# EAGLE schematic PDC Senior Project (EAGLE 7.7.0)
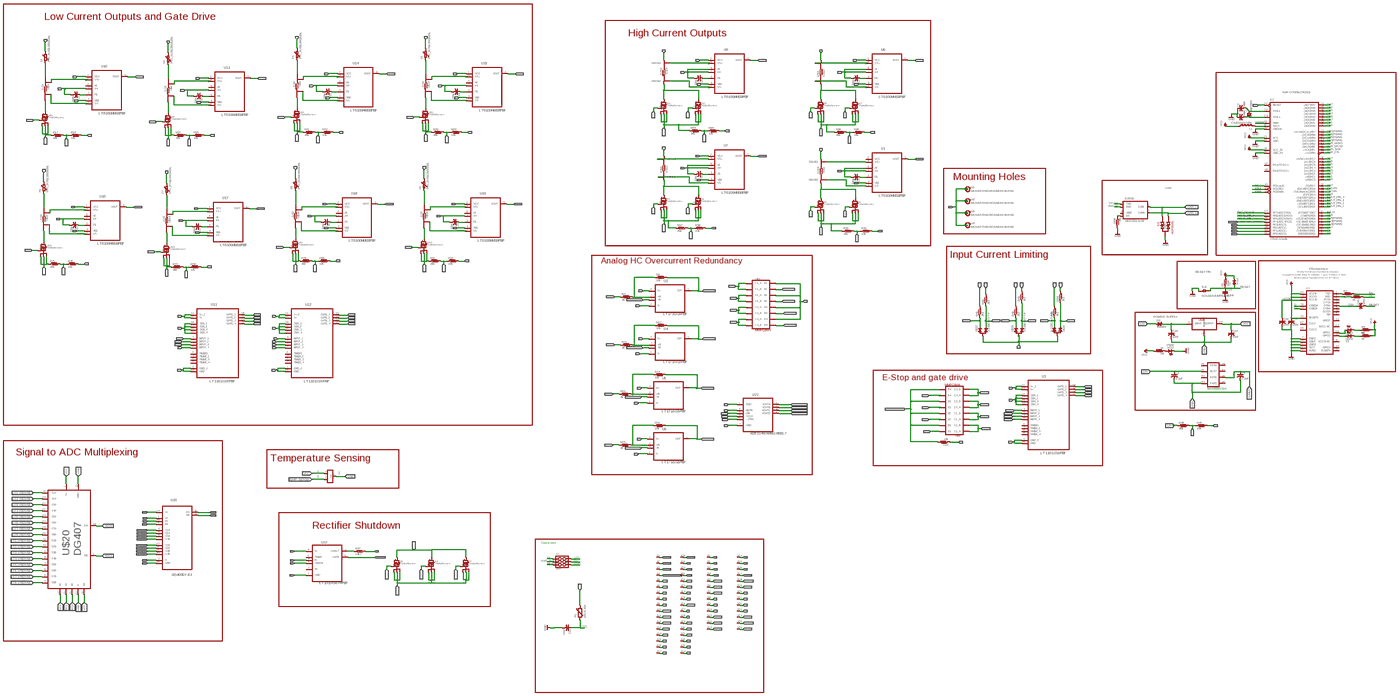
[diagram p0: schematic, sheet 1, overview]
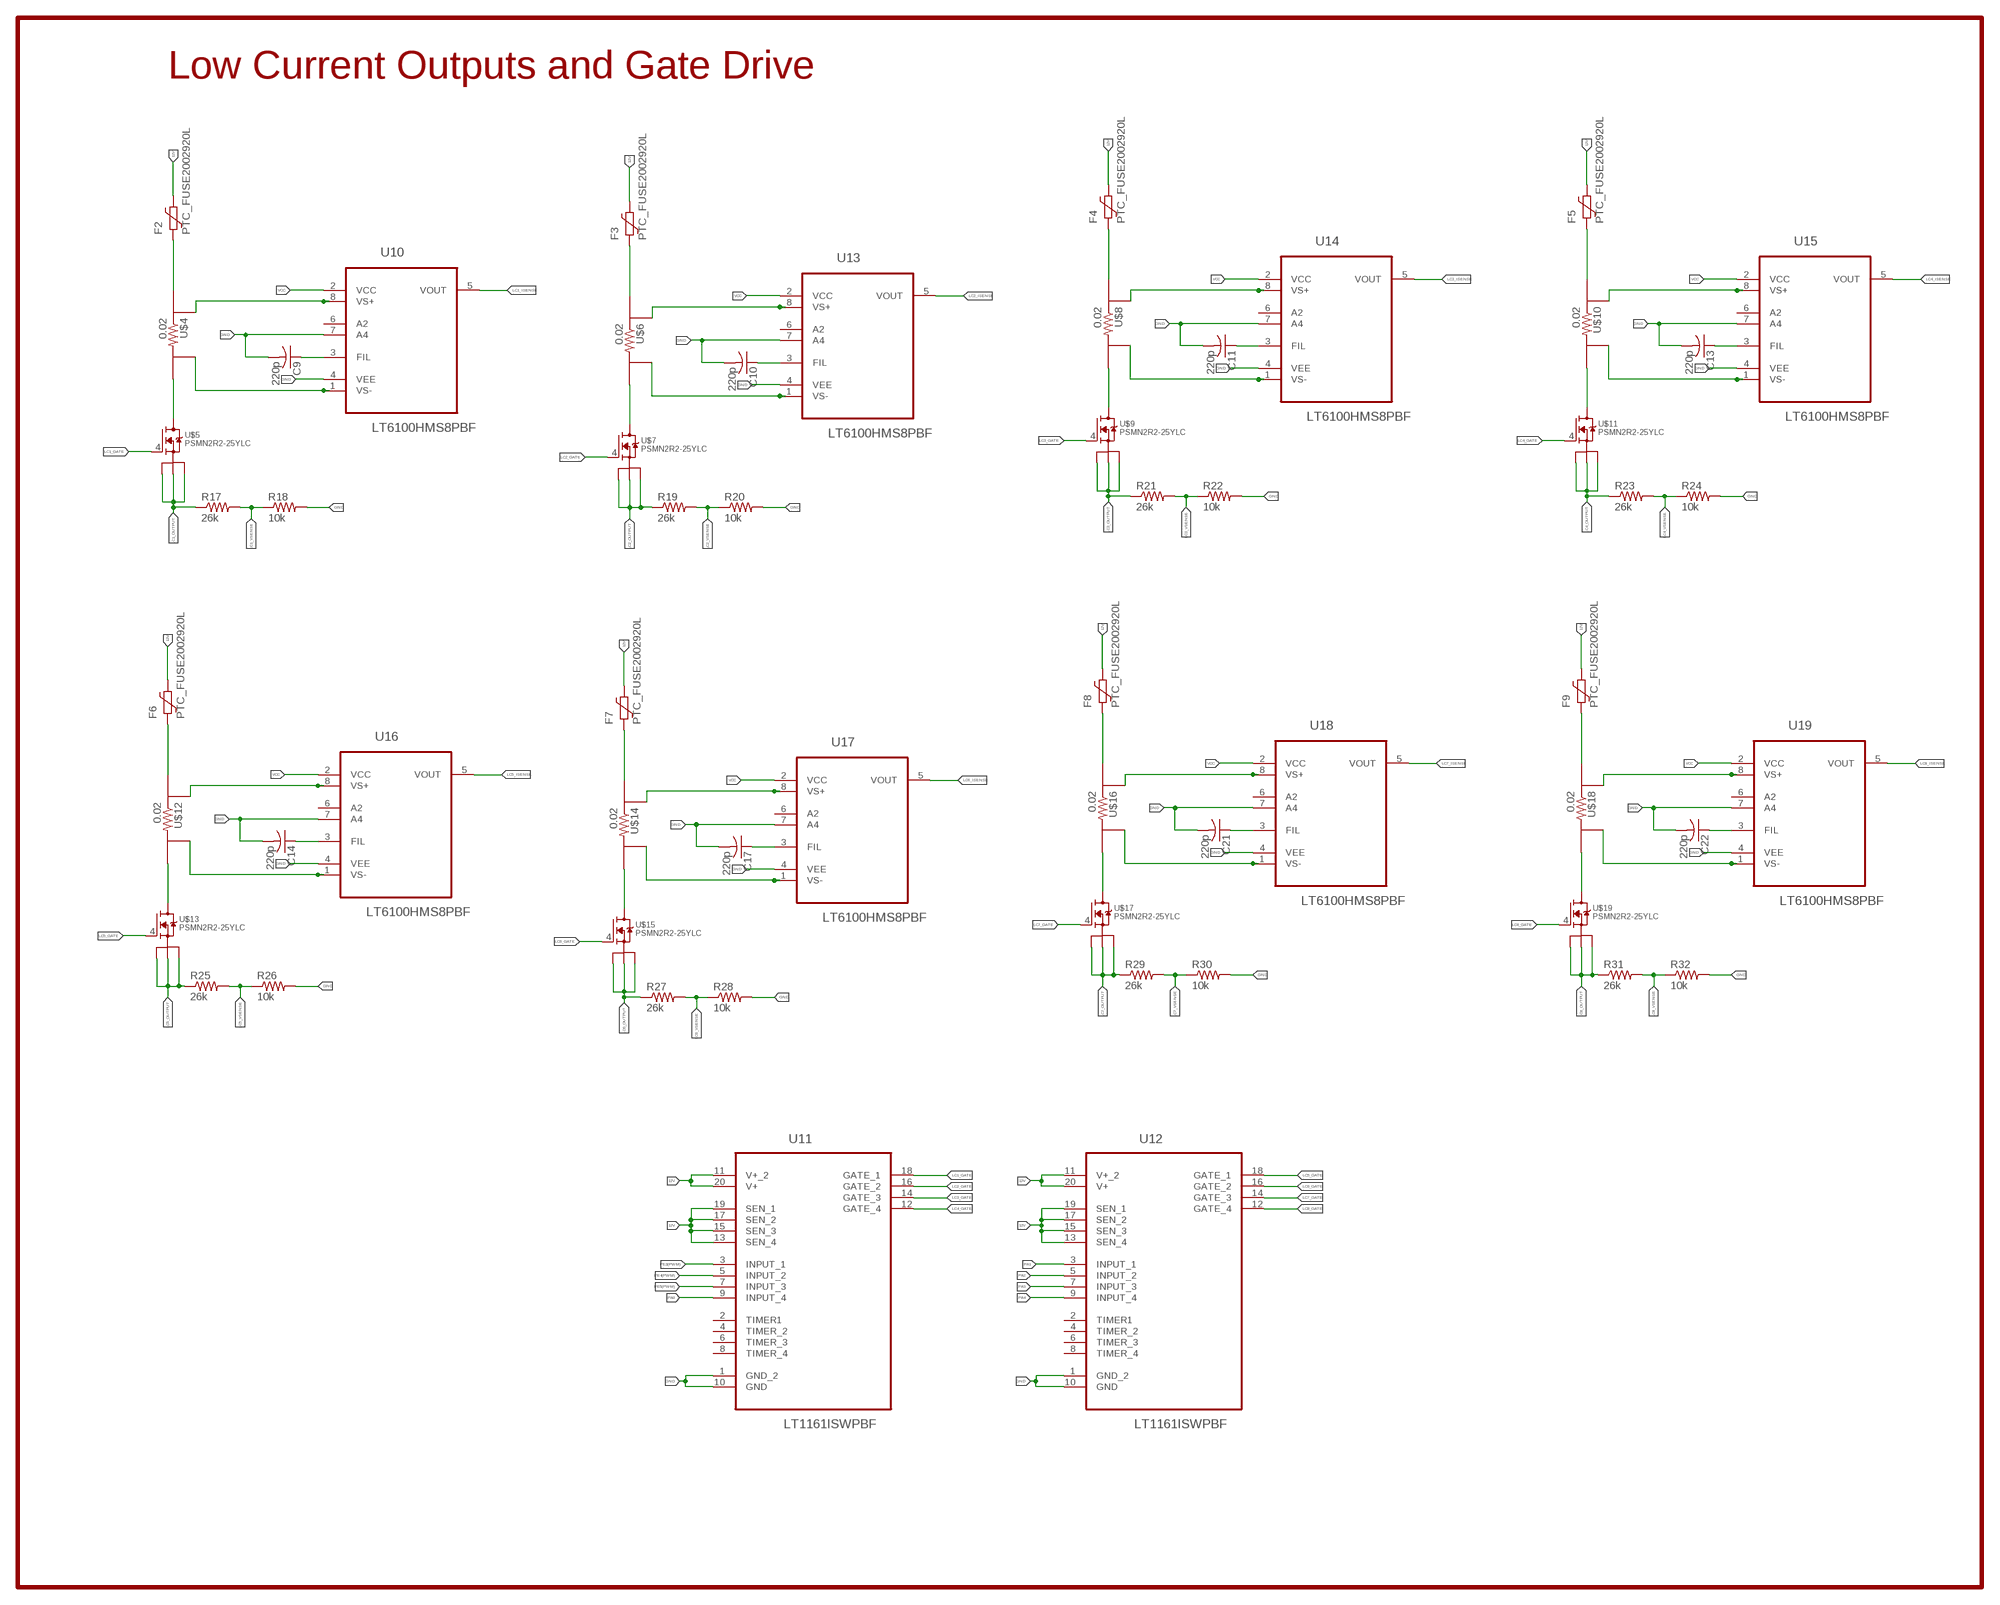
[diagram p1: schematic, sheet 1, part 1 of 6]
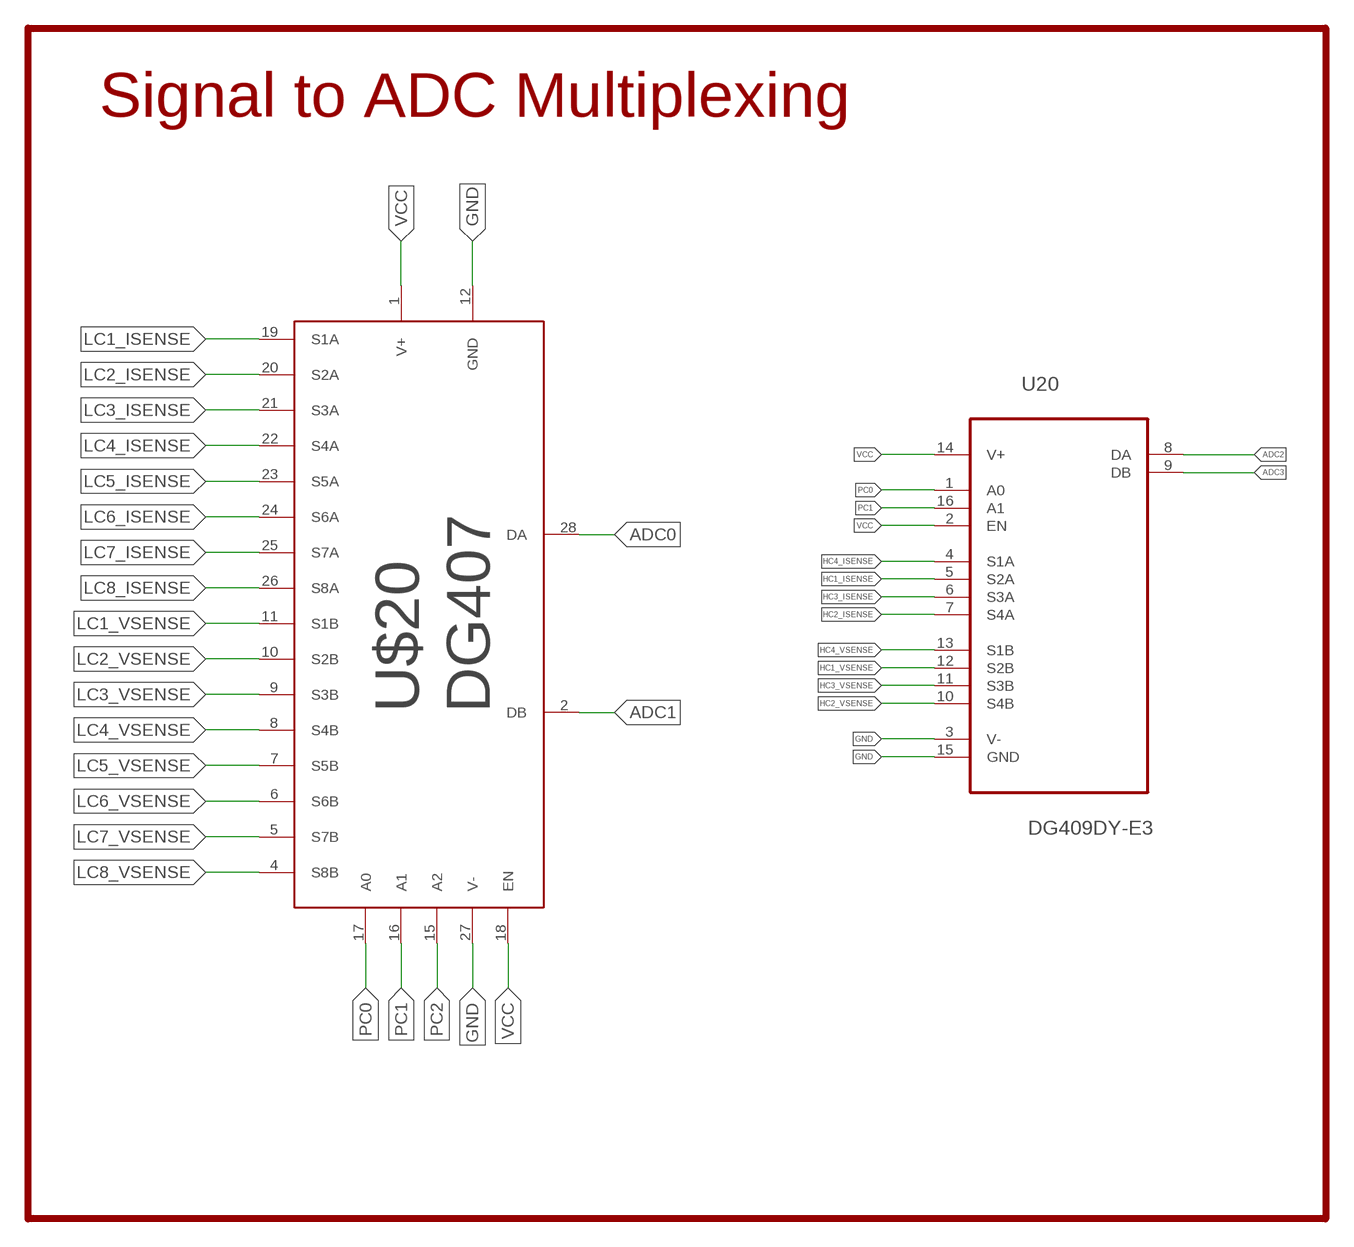
[diagram p2: schematic, sheet 1, part 2 of 6]
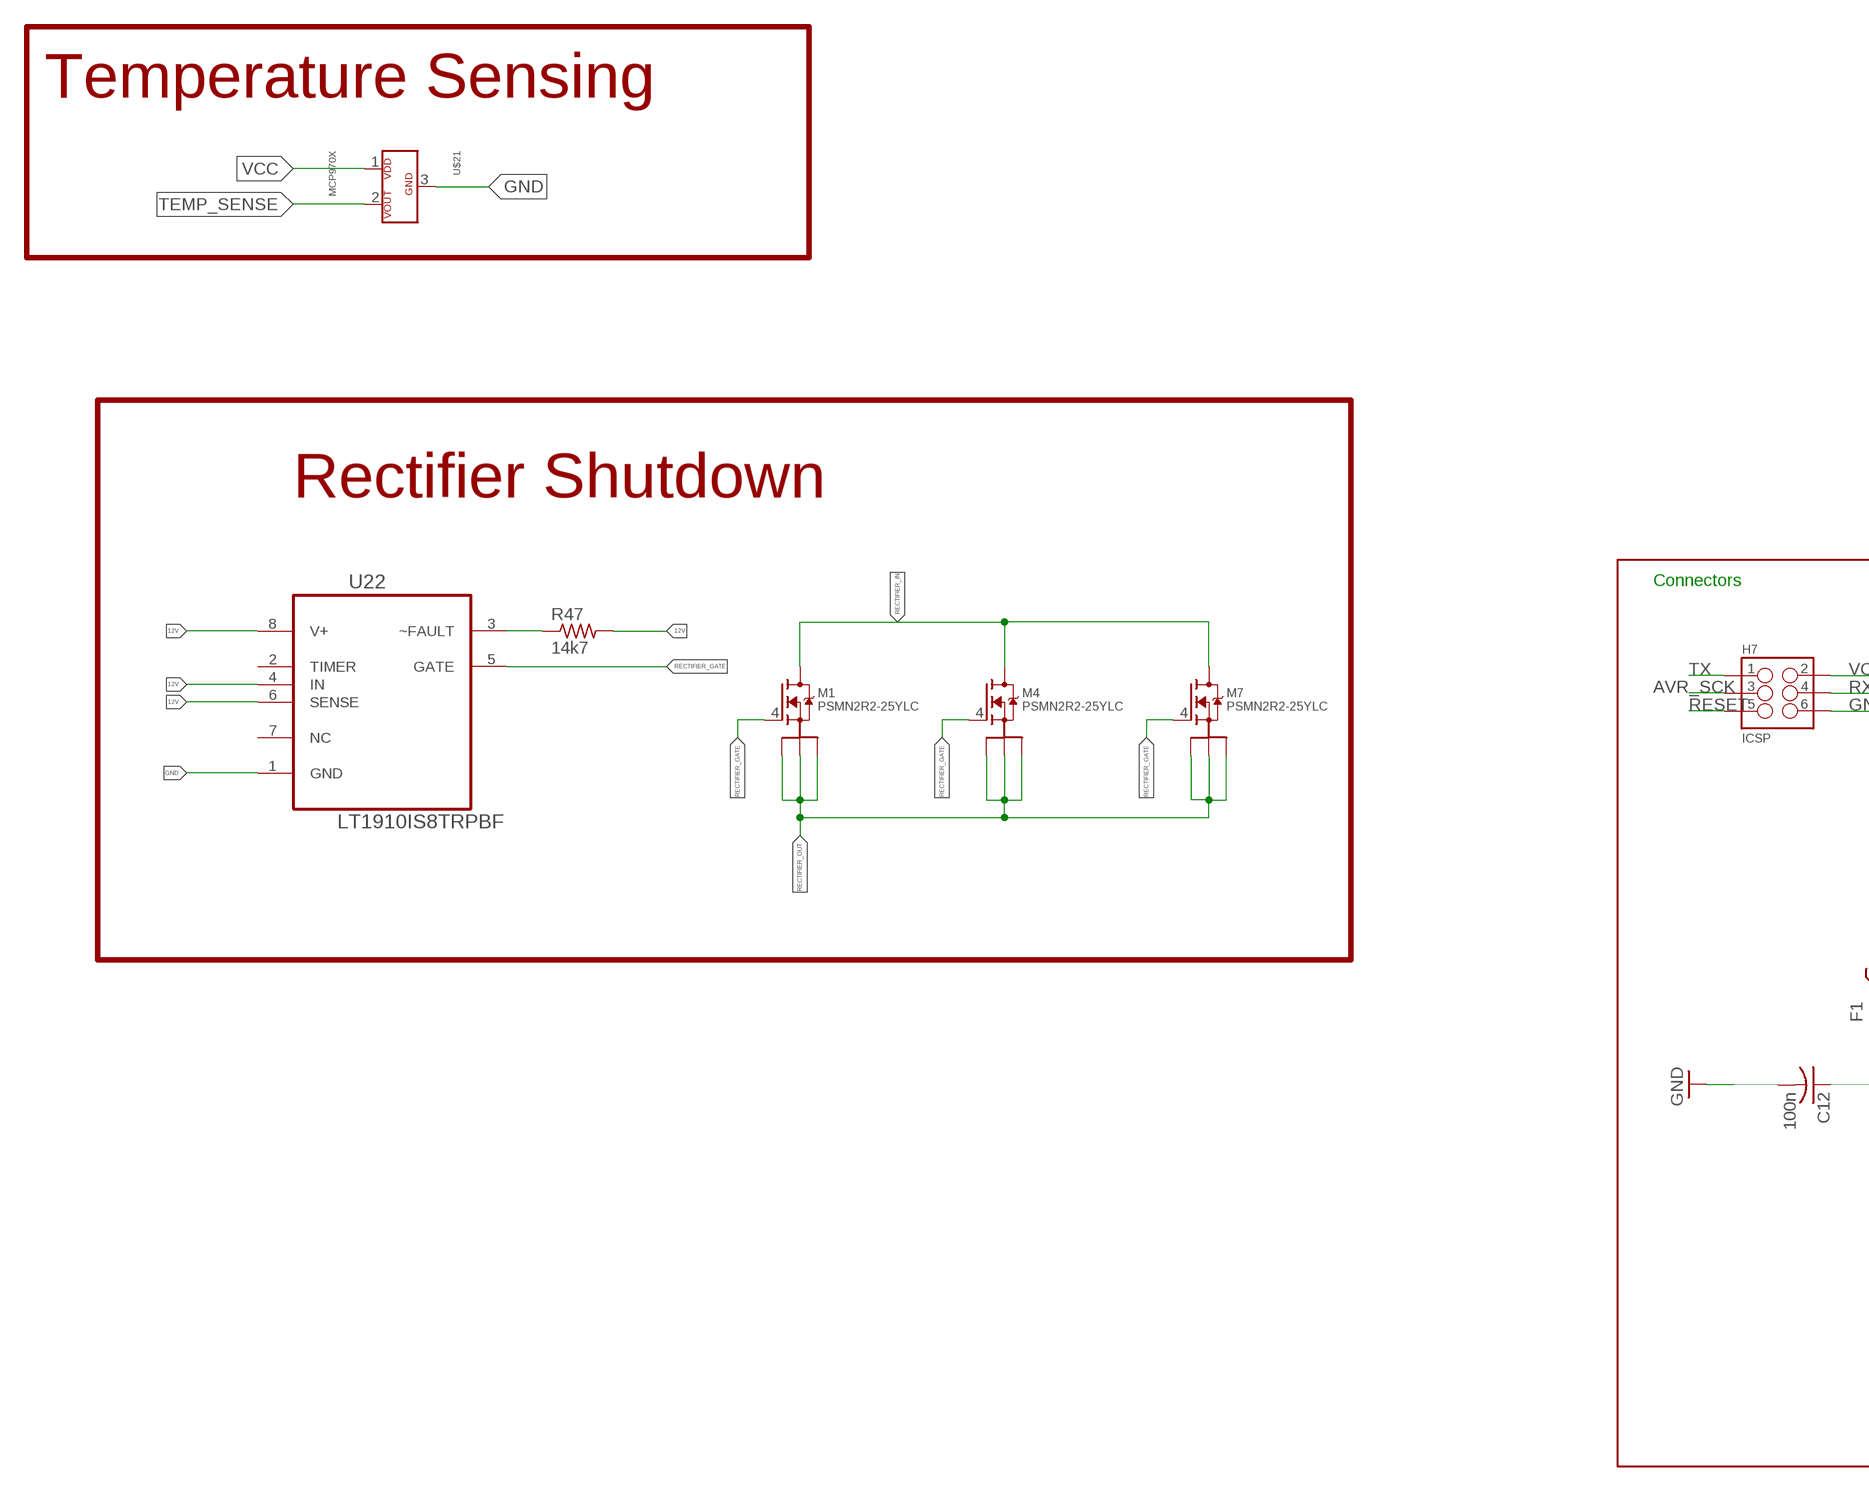
[diagram p3: schematic, sheet 1, part 3 of 6]
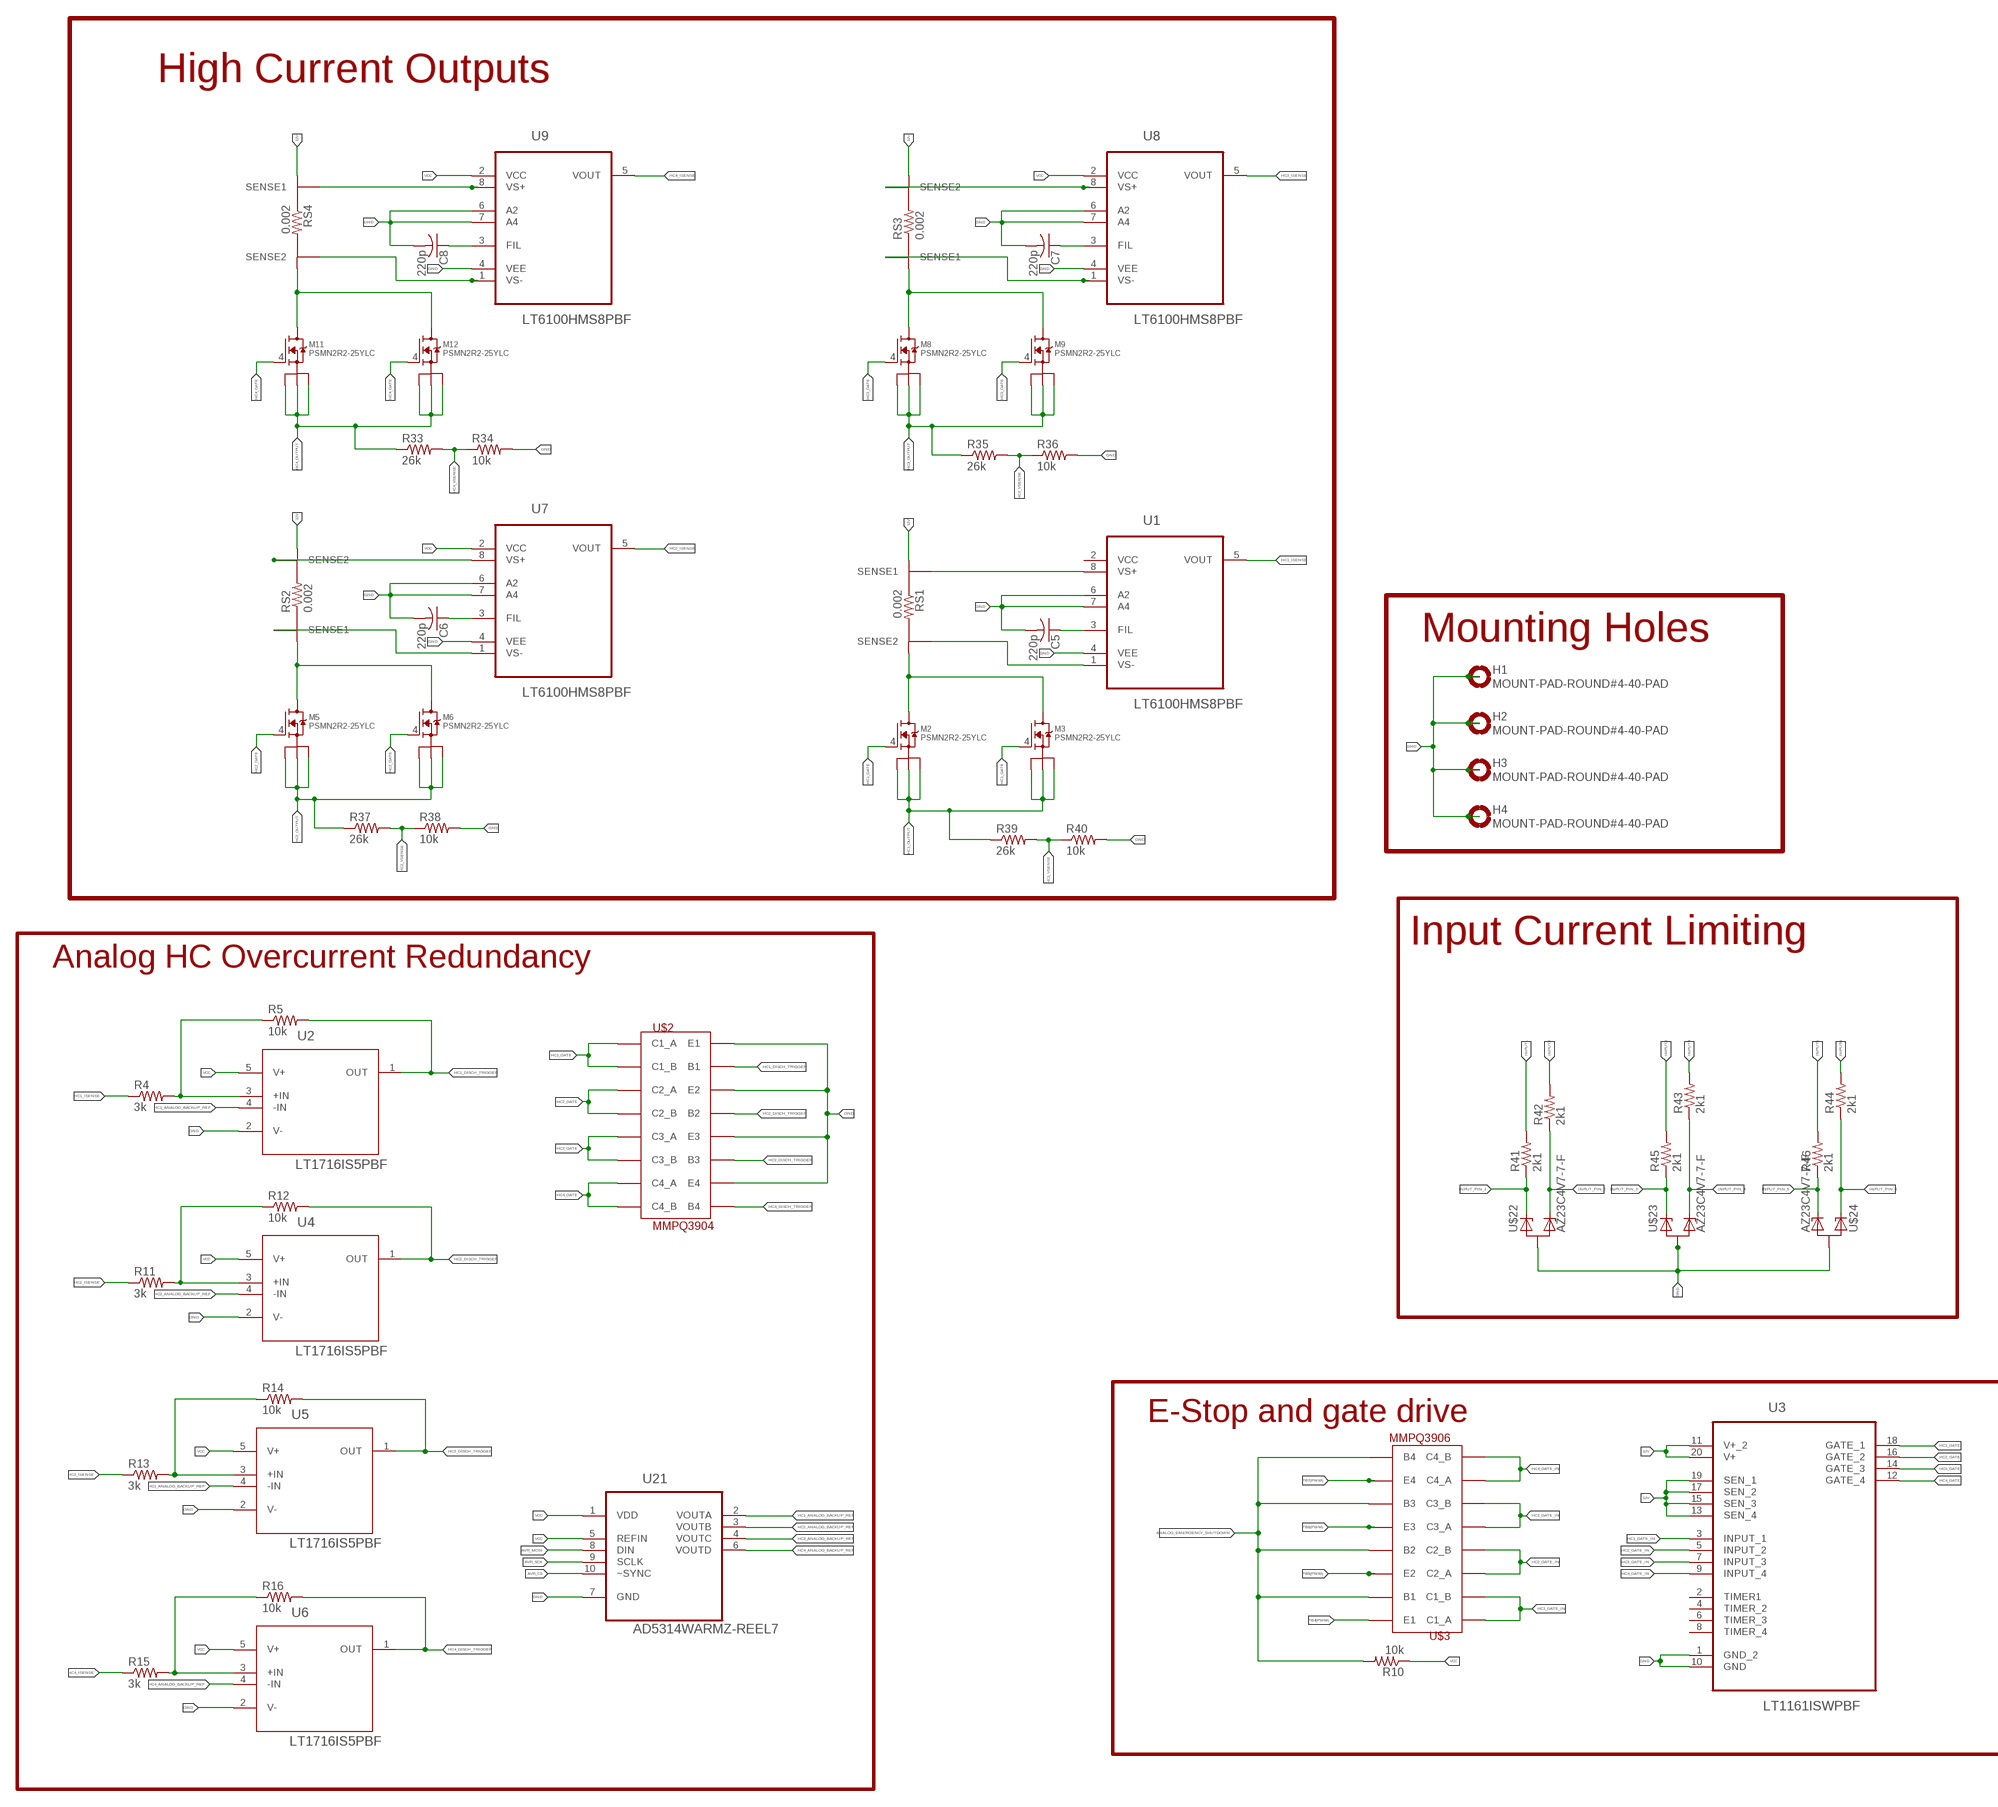
[diagram p4: schematic, sheet 1, part 4 of 6]
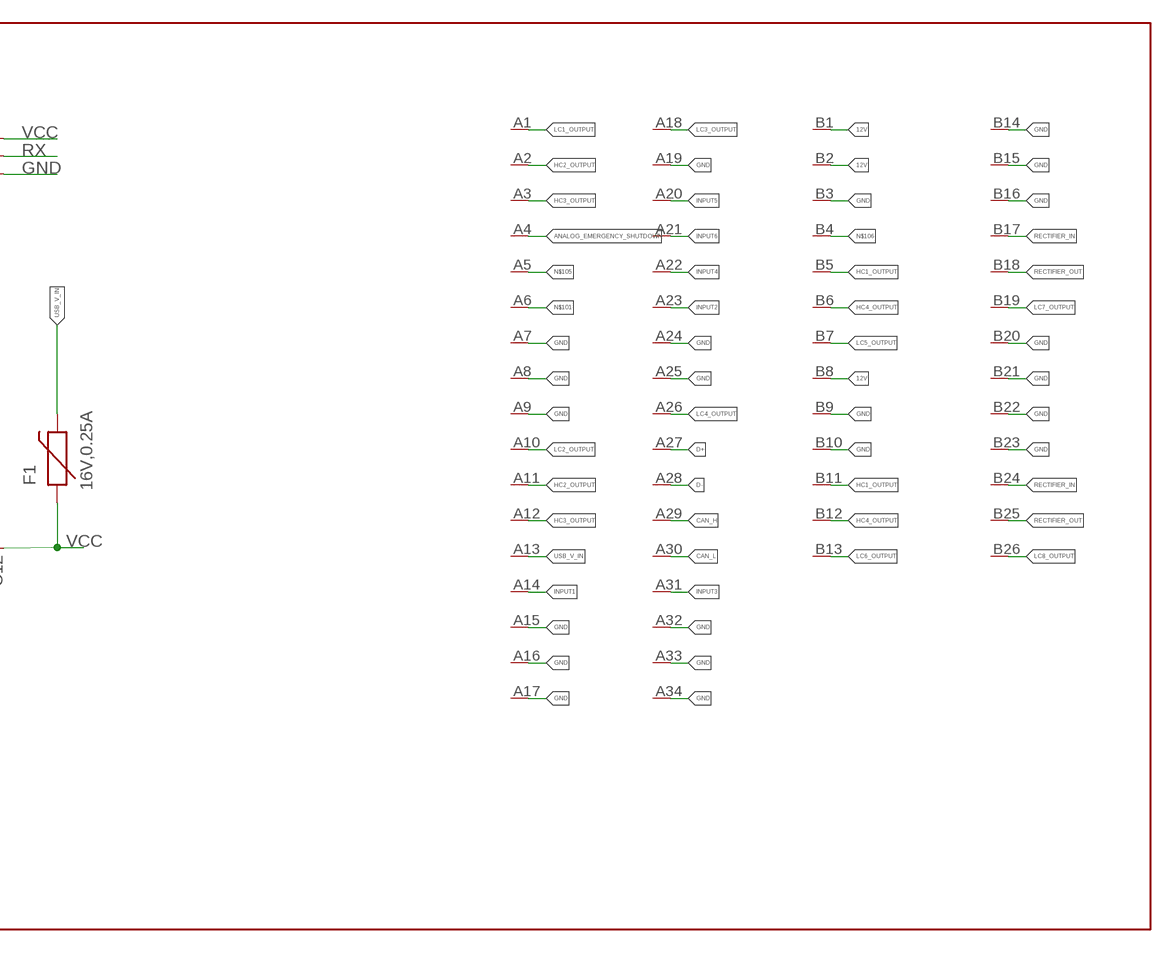
[diagram p5: schematic, sheet 1, part 5 of 6]
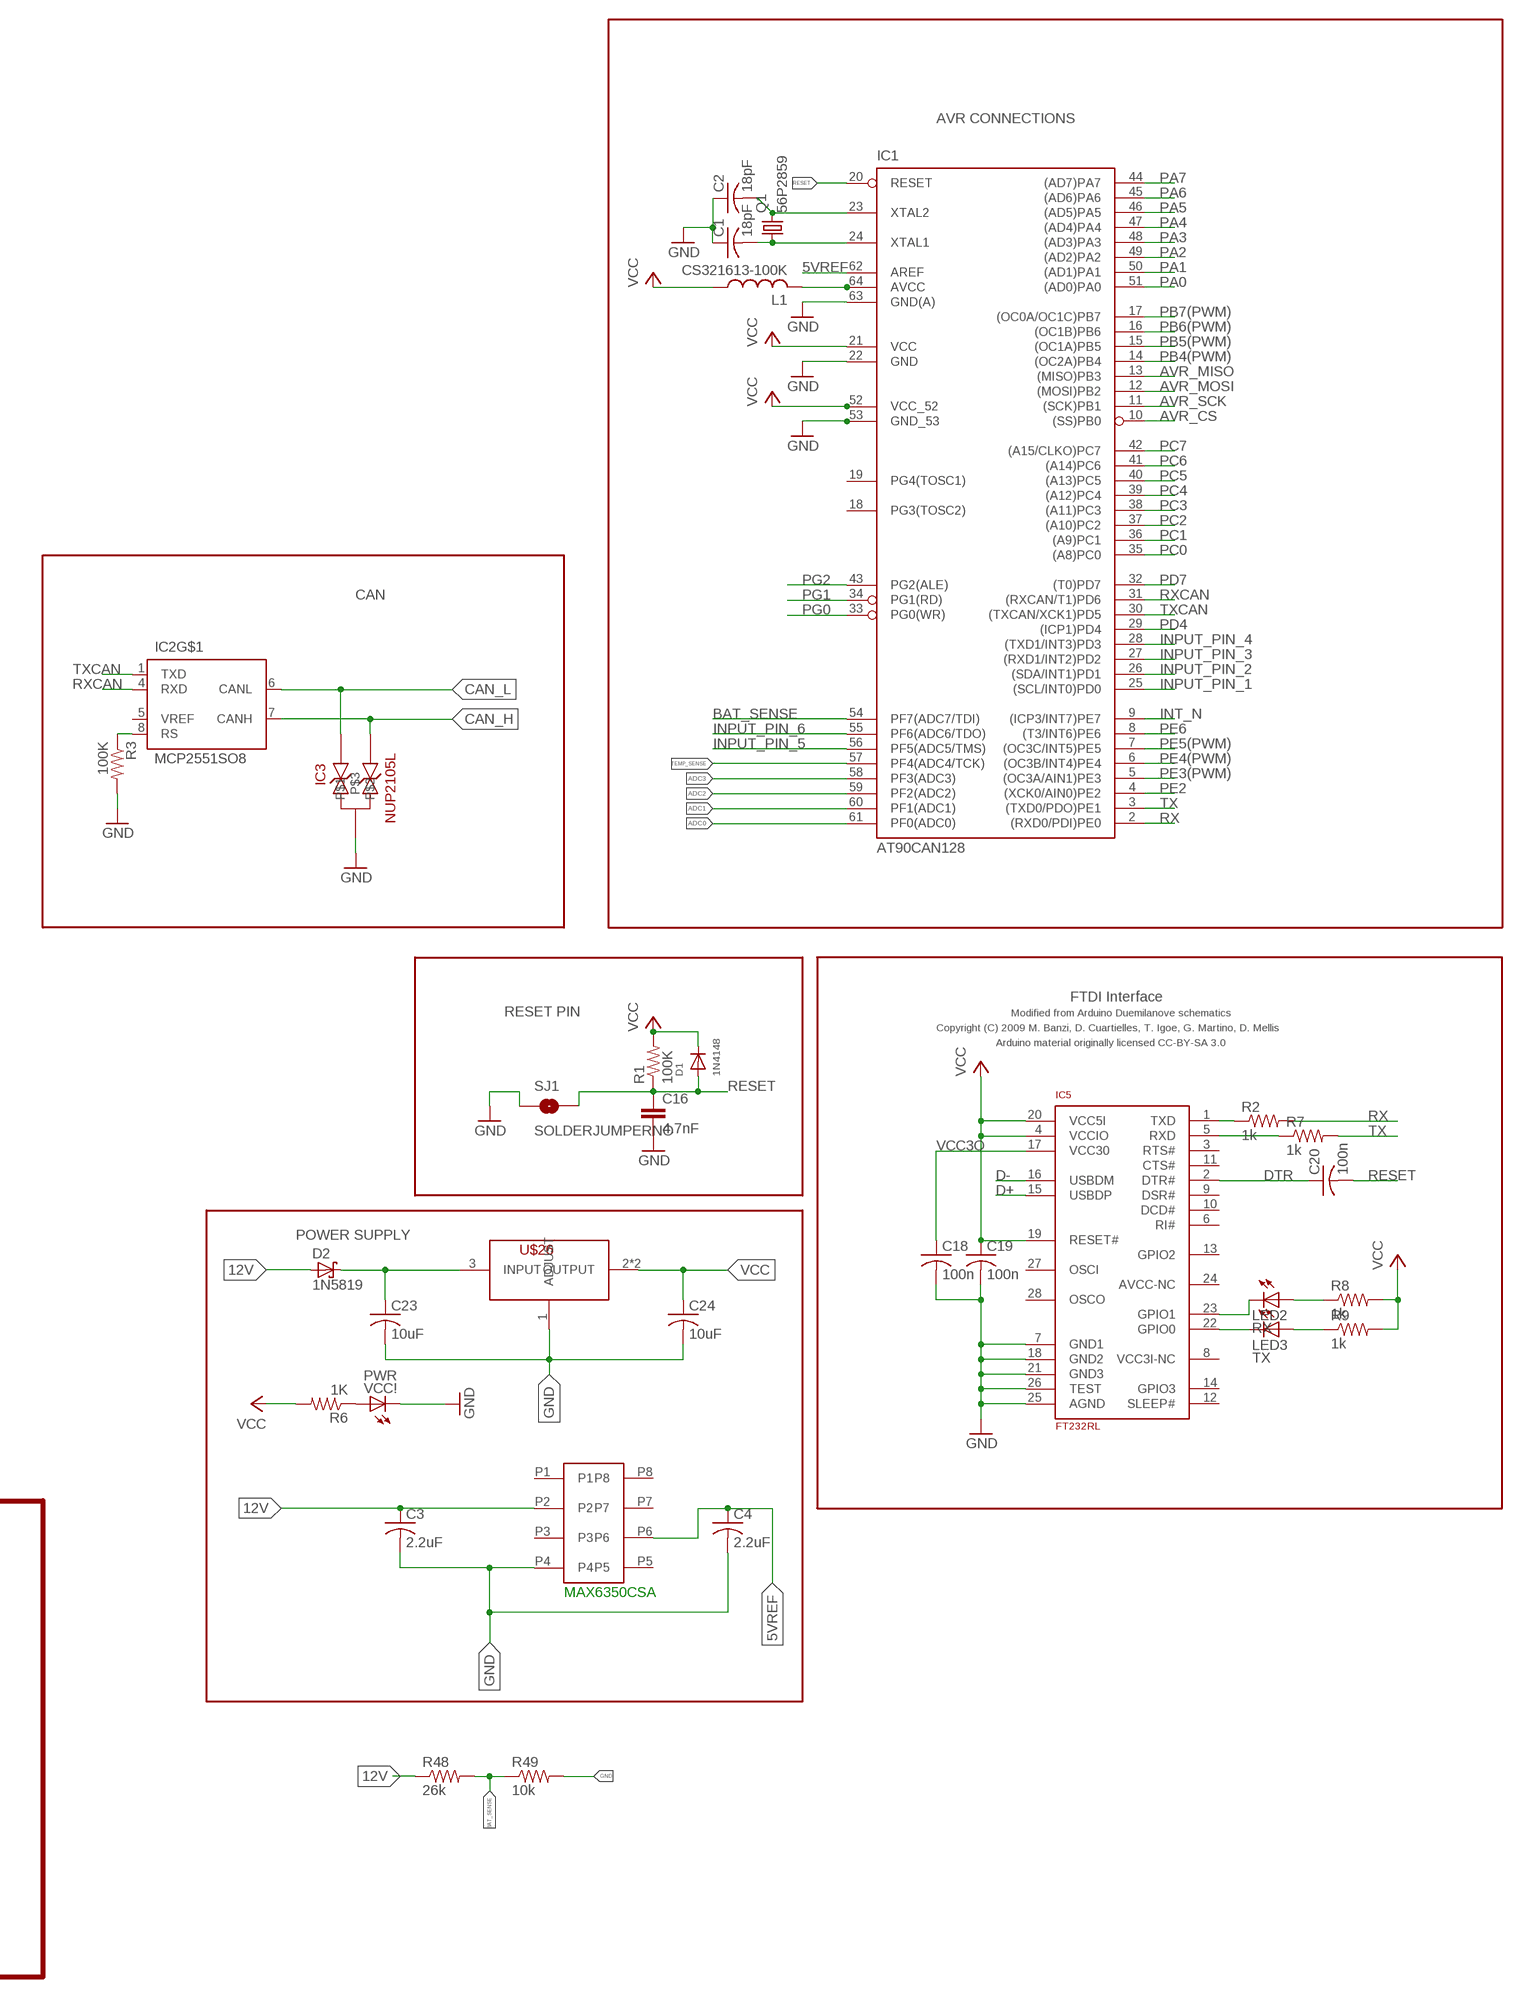
[diagram p6: schematic, sheet 1, part 6 of 6]

## Parts
C1  18pF  C-USC0805  [C0805]
C2  18pF  C-USC0805  [C0805]
C3  2.2uF  C-USC0603  [C0603]
C4  2.2uF  C-USC0603  [C0603]
C5  220p  C-USC0603  [C0603]
C6  220p  C-USC0603  [C0603]
C7  220p  C-USC0603  [C0603]
C8  220p  C-USC0603  [C0603]
C9  220p  C-USC0603  [C0603]
C10  220p  C-USC0603  [C0603]
C11  220p  C-USC0603  [C0603]
C12  100n  C-USC0805  [C0805]
C13  220p  C-USC0603  [C0603]
C14  220p  C-USC0603  [C0603]
C16  4.7nF  CAP0805  [0805]
C17  220p  C-USC0603  [C0603]
C18  100n  C-USC0805  [C0805]
C19  100n  C-USC0805  [C0805]
C20  100n  C-USC0805  [C0805]
C21  220p  C-USC0603  [C0603]
C22  220p  C-USC0603  [C0603]
C23  10uF  C-USC0603  [C0603]
C24  10uF  C-USC0603  [C0603]
D1  1N4148  DIODESOD-123  [SOD-123]
D2  1N5819  1N5819-BSOD123  [SOD123]
F1  16V,0.25A  PTCSMD  [PTC-1206]
F2  PTC_FUSE2002920L  [2920L]
F3  PTC_FUSE2002920L  [2920L]
F4  PTC_FUSE2002920L  [2920L]
F5  PTC_FUSE2002920L  [2920L]
F6  PTC_FUSE2002920L  [2920L]
F7  PTC_FUSE2002920L  [2920L]
F8  PTC_FUSE2002920L  [2920L]
F9  PTC_FUSE2002920L  [2920L]
H1  MOUNT-PAD-ROUND#4-40-PAD  [#4-40-PAD-ROUND]
H2  MOUNT-PAD-ROUND#4-40-PAD  [#4-40-PAD-ROUND]
H3  MOUNT-PAD-ROUND#4-40-PAD  [#4-40-PAD-ROUND]
H4  MOUNT-PAD-ROUND#4-40-PAD  [#4-40-PAD-ROUND]
H7  ICSP  M03X2SMD_FCI  [2X3_SMD_FCI_54202-G30]
IC1  AT90CAN128  [TQFP64]
IC2  MCP2551SO8  [SO08]
IC3  NUP2105L  [SOT-23]
IC5  FT232RL  [SSOP28]
L1  CS321613-100K  L-USL3216C  [L3216C]
LED2  RX  LEDCHIPLED_0805  [CHIPLED_0805]
LED3  TX  LEDCHIPLED_0805  [CHIPLED_0805]
M1  PSMN2R2-25YLC  [SOT669(LFPAK_POWER-SO8)]
M2  PSMN2R2-25YLC  [SOT669(LFPAK_POWER-SO8)]
M3  PSMN2R2-25YLC  [SOT669(LFPAK_POWER-SO8)]
M4  PSMN2R2-25YLC  [SOT669(LFPAK_POWER-SO8)]
M5  PSMN2R2-25YLC  [SOT669(LFPAK_POWER-SO8)]
M6  PSMN2R2-25YLC  [SOT669(LFPAK_POWER-SO8)]
M7  PSMN2R2-25YLC  [SOT669(LFPAK_POWER-SO8)]
M8  PSMN2R2-25YLC  [SOT669(LFPAK_POWER-SO8)]
M9  PSMN2R2-25YLC  [SOT669(LFPAK_POWER-SO8)]
M11  PSMN2R2-25YLC  [SOT669(LFPAK_POWER-SO8)]
M12  PSMN2R2-25YLC  [SOT669(LFPAK_POWER-SO8)]
Q1  56P2859  CRYSTALSMD  [HC49UP]
R1  100K  R-US_R0805  [R0805]
R2  1k  R-US_R0805  [R0805]
R3  100K  R-US_R0805  [R0805]
R4  3k  R-US_R0603  [R0603]
R5  10k  R-US_R0603  [R0603]
R6  1K  R-US_R0805  [R0805]
R7  1k  R-US_R0805  [R0805]
R8  1k  R-US_R0805  [R0805]
R9  1k  R-US_R0805  [R0805]
R10  10k  R-US_R0603  [R0603]
R11  3k  R-US_R0603  [R0603]
R12  10k  R-US_R0603  [R0603]
R13  3k  R-US_R0603  [R0603]
R14  10k  R-US_R0603  [R0603]
R15  3k  R-US_R0603  [R0603]
R16  10k  R-US_R0603  [R0603]
R17  26k  R-US_R0603  [R0603]
R18  10k  R-US_R0603  [R0603]
R19  26k  R-US_R0603  [R0603]
R20  10k  R-US_R0603  [R0603]
R21  26k  R-US_R0603  [R0603]
R22  10k  R-US_R0603  [R0603]
R23  26k  R-US_R0603  [R0603]
R24  10k  R-US_R0603  [R0603]
R25  26k  R-US_R0603  [R0603]
R26  10k  R-US_R0603  [R0603]
R27  26k  R-US_R0603  [R0603]
R28  10k  R-US_R0603  [R0603]
R29  26k  R-US_R0603  [R0603]
R30  10k  R-US_R0603  [R0603]
R31  26k  R-US_R0603  [R0603]
R32  10k  R-US_R0603  [R0603]
R33  26k  R-US_R0603  [R0603]
R34  10k  R-US_R0603  [R0603]
R35  26k  R-US_R0603  [R0603]
R36  10k  R-US_R0603  [R0603]
R37  26k  R-US_R0603  [R0603]
R38  10k  R-US_R0603  [R0603]
R39  26k  R-US_R0603  [R0603]
R40  10k  R-US_R0603  [R0603]
R41  2k1  R-US_R0603  [R0603]
R42  2k1  R-US_R0603  [R0603]
R43  2k1  R-US_R0603  [R0603]
R44  2k1  R-US_R0603  [R0603]
R45  2k1  R-US_R0603  [R0603]
R46  2k1  R-US_R0603  [R0603]
R47  14k7  R-US_R0603  [R0603]
R48  26k  R-US_R0603  [R0603]
R49  10k  R-US_R0603  [R0603]
RS1  0.002  WSL2726_RES  [WSL2726_RES]
RS2  0.002  WSL2726_RES  [WSL2726_RES]
RS3  0.002  WSL2726_RES  [WSL2726_RES]
RS4  0.002  WSL2726_RES  [WSL2726_RES]
SJ1  SOLDERJUMPERNO  [SJ_2S-NO]
U1  LT6100HMS8PBF  [SOP65P490X110-8N]
U2  LT1716IS5PBF  [SOT95P280X100-5N]
U3  LT1161ISWPBF  [SOIC127P1032X264-20N]
U4  LT1716IS5PBF  [SOT95P280X100-5N]
U5  LT1716IS5PBF  [SOT95P280X100-5N]
U6  LT1716IS5PBF  [SOT95P280X100-5N]
U7  LT6100HMS8PBF  [SOP65P490X110-8N]
U8  LT6100HMS8PBF  [SOP65P490X110-8N]
U9  LT6100HMS8PBF  [SOP65P490X110-8N]
U10  LT6100HMS8PBF  [SOP65P490X110-8N]
U11  LT1161ISWPBF  [SOIC127P1032X264-20N]
U12  LT1161ISWPBF  [SOIC127P1032X264-20N]
U13  LT6100HMS8PBF  [SOP65P490X110-8N]
U14  LT6100HMS8PBF  [SOP65P490X110-8N]
U15  LT6100HMS8PBF  [SOP65P490X110-8N]
U16  LT6100HMS8PBF  [SOP65P490X110-8N]
U17  LT6100HMS8PBF  [SOP65P490X110-8N]
U18  LT6100HMS8PBF  [SOP65P490X110-8N]
U19  LT6100HMS8PBF  [SOP65P490X110-8N]
U20  DG409DY-E3  [SOIC127P600X175-16N]
U21  AD5314WARMZ-REEL7  [SOP50P490X110-10N]
U22  LT1910IS8TRPBF  [SOIC127P600X175-8N]
U$2  MMPQ3904  [SOIC16NB]
U$3  MMPQ3906  [SOIC16NB]
U$4  0.02  LVK_SERIES  [LVK2010]
U$4V5V  MAX6350CSA  [8-SOIC]
U$5  PSMN2R2-25YLC  [SOT669(LFPAK_POWER-SO8)]
U$6  0.02  LVK_SERIES  [LVK2010]
U$7  PSMN2R2-25YLC  [SOT669(LFPAK_POWER-SO8)]
U$8  0.02  LVK_SERIES  [LVK2010]
U$9  PSMN2R2-25YLC  [SOT669(LFPAK_POWER-SO8)]
U$10  0.02  LVK_SERIES  [LVK2010]
U$11  PSMN2R2-25YLC  [SOT669(LFPAK_POWER-SO8)]
U$12  0.02  LVK_SERIES  [LVK2010]
U$13  PSMN2R2-25YLC  [SOT669(LFPAK_POWER-SO8)]
U$14  0.02  LVK_SERIES  [LVK2010]
U$15  PSMN2R2-25YLC  [SOT669(LFPAK_POWER-SO8)]
U$16  0.02  LVK_SERIES  [LVK2010]
U$17  PSMN2R2-25YLC  [SOT669(LFPAK_POWER-SO8)]
U$18  0.02  LVK_SERIES  [LVK2010]
U$19  PSMN2R2-25YLC  [SOT669(LFPAK_POWER-SO8)]
U$20  DG407  [PLCC28S]
U$21  MCP970X  [SOT23]
U$22  AZ23C4V7-7-F  [SOT23-3]
U$23  AZ23C4V7-7-F  [SOT23-3]
U$24  AZ23C4V7-7-F  [SOT23-3]
U$25  SUPERSEAL1.0_60POS  [SUPERSEAL1.0_60POS]
U$26  NCP1117  [SOT-223-4]
VCC!  PWR  LEDCHIPLED_0805  [CHIPLED_0805]

## Nets
5V_REG_IN: C23.1 D2.C U$26.3(INPUT)
5VREF: C4.1 IC1.62(AREF) U$4V5V.P6
12V: C3.1 D2.A F2.1 F3.1 F4.1 F5.1 F6.1 F7.1 F8.1 F9.1 R47.2 R48.1 RS1.PAS1 RS2.PAS2 RS3.PAS2 RS4.PAS1 U3.11(V+_2) U3.13(SEN_4) U3.15(SEN_3) U3.17(SEN_2) U3.19(SEN_1) U3.20(V+) U11.11(V+_2) U11.13(SEN_4) U11.15(SEN_3) U11.17(SEN_2) U11.19(SEN_1) U11.20(V+) U12.11(V+_2) U12.13(SEN_4) U12.15(SEN_3) U12.17(SEN_2) U12.19(SEN_1) U12.20(V+) U22.4(IN) U22.6(SENSE) U22.8(V+) U$4V5V.P2 U$25.B1 U$25.B2 U$25.B8
ADC0: IC1.61(PF0(ADC0)) U$20.28(DA)
ADC1: IC1.60(PF1(ADC1)) U$20.2(DB)
ADC2: IC1.59(PF2(ADC2)) U20.8(DA)
ADC3: IC1.58(PF3(ADC3)) U20.9(DB)
ANALOG_EMERGENCY_SHUTDOWN: R10.2 U$3.9(B4) U$3.11(B3) U$3.13(B2) U$3.15(B1) U$25.A4
AVR_CS: IC1.10((SS)PB0) U21.10(~SYNC)
AVR_MISO: IC1.13((MISO)PB3)
AVR_MOSI: IC1.12((MOSI)PB2) U21.8(DIN)
AVR_SCK: H7.3 IC1.11((SCK)PB1) U21.9(SCLK)
BAT_SENSE: IC1.54(PF7(ADC7/TDI)) R48.2 R49.1
CAN_H: IC2.7(CANH) IC3.2 U$25.A29
CAN_L: IC2.6(CANL) IC3.1 U$25.A30
D+: IC5.15(USBDP) U$25.A27
D-: IC5.16(USBDM) U$25.A28
DTR: C20.1 IC5.2(DTR#)
GND: C1.1 C2.1 C3.2 C4.2 C5.2 C6.2 C7.2 C8.2 C9.2 C10.2 C11.2 C12.2 C13.2 C14.2 C16.2 C17.2 C18.2 C19.2 C21.2 C22.2 C23.2 C24.2 H1.P$1(MOUNT) H2.P$1(MOUNT) H3.P$1(MOUNT) H4.P$1(MOUNT) H7.6 IC1.22(GND) IC1.53(GND_53) IC1.63(GND(A)) IC3.3 IC5.7(GND1) IC5.18(GND2) IC5.21(GND3) IC5.25(AGND) IC5.26(TEST) R3.2 R18.2 R20.2 R22.2 R24.2 R26.2 R28.2 R30.2 R32.2 R34.2 R36.2 R38.2 R40.2 R49.2 SJ1.1 U1.4(VEE) U1.6(A2) U1.7(A4) U2.2(V-) U3.1(GND_2) U3.10(GND) U4.2(V-) U5.2(V-) U6.2(V-) U7.4(VEE) U7.6(A2) U7.7(A4) U8.4(VEE) U8.6(A2) U8.7(A4) U9.4(VEE) U9.6(A2) U9.7(A4) U10.4(VEE) U10.7(A4) U11.1(GND_2) U11.10(GND) U12.1(GND_2) U12.10(GND) U13.4(VEE) U13.7(A4) U14.4(VEE) U14.7(A4) U15.4(VEE) U15.7(A4) U16.4(VEE) U16.7(A4) U17.4(VEE) U17.7(A4) U18.4(VEE) U18.7(A4) U19.4(VEE) U19.7(A4) U20.3(V-) U20.15(GND) U21.7(GND) U22.1(GND) U$2.10(E4) U$2.12(E3) U$2.14(E2) U$2.16(E1) U$4V5V.P4 U$20.12(GND) U$20.27(V-) U$21.3(GND) U$22.3 U$23.3 U$24.3 U$25.A7 U$25.A8 U$25.A9 U$25.A15 U$25.A16 U$25.A17 U$25.A19 U$25.A24 U$25.A25 U$25.A32 U$25.A33 U$25.A34 U$25.B3 U$25.B9 U$25.B10 U$25.B14 U$25.B15 U$25.B16 U$25.B20 U$25.B21 U$25.B22 U$25.B23 U$26.1(ADJUST) VCC!.C
HC1_ANALOG_BACKUP_REF: U2.4(-IN) U21.2(VOUTA)
HC1_DISCH_TRIGGER: R5.2 U2.1(OUT) U$2.15(B1)
HC1_GATE: M2.4(G) M3.4(G) U3.18(GATE_1) U$2.1(C1_A) U$2.2(C1_B)
HC1_GATE_IN: U3.3(INPUT_1) U$3.1(C1_A) U$3.2(C1_B)
HC1_ISENSE: R4.1 U1.5(VOUT) U20.5(S2A)
HC1_OUTPUT: M2.1(S1) M2.2(S2) M2.3(S3) M3.1(S1) M3.2(S2) M3.3(S3) R39.1 U$25.B5 U$25.B11
HC1_VSENSE: R39.2 R40.1 U20.12(S2B)
HC2_ANALOG_BACKUP_REF: U4.4(-IN) U21.3(VOUTB)
HC2_DISCH_TRIGGER: R12.2 U4.1(OUT) U$2.13(B2)
HC2_GATE: M5.4(G) M6.4(G) U3.16(GATE_2) U$2.3(C2_A) U$2.4(C2_B)
HC2_GATE_IN: U3.5(INPUT_2) U$3.3(C2_A) U$3.4(C2_B)
HC2_ISENSE: R11.1 U7.5(VOUT) U20.7(S4A)
HC2_OUTPUT: M5.1(S1) M5.2(S2) M5.3(S3) M6.1(S1) M6.2(S2) M6.3(S3) R37.1 U$25.A2 U$25.A11
HC2_VSENSE: R37.2 R38.1 U20.10(S4B)
HC3_ANALOG_BACKUP_REF: U5.4(-IN) U21.4(VOUTC)
HC3_DISCH_TRIGGER: R14.2 U5.1(OUT) U$2.11(B3)
HC3_GATE: M8.4(G) M9.4(G) U3.14(GATE_3) U$2.5(C3_A) U$2.6(C3_B)
HC3_GATE_IN: U3.7(INPUT_3) U$3.5(C3_A) U$3.6(C3_B)
HC3_ISENSE: R13.1 U8.5(VOUT) U20.6(S3A)
HC3_OUTPUT: M8.1(S1) M8.2(S2) M8.3(S3) M9.1(S1) M9.2(S2) M9.3(S3) R35.1 U$25.A3 U$25.A12
HC3_VSENSE: R35.2 R36.1 U20.11(S3B)
HC4_ANALOG_BACKUP_REF: U6.4(-IN) U21.6(VOUTD)
HC4_DISCH_TRIGGER: R16.2 U6.1(OUT) U$2.9(B4)
HC4_GATE: M11.4(G) M12.4(G) U3.12(GATE_4) U$2.7(C4_A) U$2.8(C4_B)
HC4_GATE_IN: U3.9(INPUT_4) U$3.7(C4_A) U$3.8(C4_B)
HC4_ISENSE: R15.1 U9.5(VOUT) U20.4(S1A)
HC4_OUTPUT: M11.1(S1) M11.2(S2) M11.3(S3) M12.1(S1) M12.2(S2) M12.3(S3) R33.1 U$25.B6 U$25.B12
HC4_VSENSE: R33.2 R34.1 U20.13(S1B)
INPUT1: R41.2 U$25.A14
INPUT2: R42.2 U$25.A23
INPUT3: R45.2 U$25.A31
INPUT4: R43.2 U$25.A22
INPUT5: R46.2 U$25.A20
INPUT6: R44.2 U$25.A21
INPUT_PIN_1: IC1.25((SCL/INT0)PD0) R41.1 U$22.2
INPUT_PIN_2: IC1.26((SDA/INT1)PD1) R42.1 U$22.1
INPUT_PIN_3: IC1.27((RXD1/INT2)PD2) R45.1 U$23.2
INPUT_PIN_4: IC1.28((TXD1/INT3)PD3) R43.1 U$23.1
INPUT_PIN_5: IC1.56(PF5(ADC5/TMS)) R46.1 U$24.1
INPUT_PIN_6: IC1.55(PF6(ADC6/TDO)) R44.1 U$24.2
INT_N: IC1.9((ICP3/INT7)PE7)
LC1_GATE: U11.18(GATE_1) U$5.4(G)
LC1_ISENSE: U10.5(VOUT) U$20.19(S1A)
LC1_OUTPUT: R17.1 U$5.1(S1) U$5.2(S2) U$5.3(S3) U$25.A1
LC1_VSENSE: R17.2 R18.1 U$20.11(S1B)
LC2_GATE: U11.16(GATE_2) U$7.4(G)
LC2_ISENSE: U13.5(VOUT) U$20.20(S2A)
LC2_OUTPUT: R19.1 U$7.1(S1) U$7.2(S2) U$7.3(S3) U$25.A10
LC2_VSENSE: R19.2 R20.1 U$20.10(S2B)
LC3_GATE: U11.14(GATE_3) U$9.4(G)
LC3_ISENSE: U14.5(VOUT) U$20.21(S3A)
LC3_OUTPUT: R21.1 U$9.1(S1) U$9.2(S2) U$9.3(S3) U$25.A18
LC3_VSENSE: R21.2 R22.1 U$20.9(S3B)
LC4_GATE: U11.12(GATE_4) U$11.4(G)
LC4_ISENSE: U15.5(VOUT) U$20.22(S4A)
LC4_OUTPUT: R23.1 U$11.1(S1) U$11.2(S2) U$11.3(S3) U$25.A26
LC4_VSENSE: R23.2 R24.1 U$20.8(S4B)
LC5_GATE: U12.18(GATE_1) U$13.4(G)
LC5_ISENSE: U16.5(VOUT) U$20.23(S5A)
LC5_OUTPUT: R25.1 U$13.1(S1) U$13.2(S2) U$13.3(S3) U$25.B7
LC5_VSENSE: R25.2 R26.1 U$20.7(S5B)
LC6_GATE: U12.16(GATE_2) U$15.4(G)
LC6_ISENSE: U17.5(VOUT) U$20.24(S6A)
LC6_OUTPUT: R27.1 U$15.1(S1) U$15.2(S2) U$15.3(S3) U$25.B13
LC6_VSENSE: R27.2 R28.1 U$20.6(S6B)
LC7_GATE: U12.14(GATE_3) U$17.4(G)
LC7_ISENSE: U18.5(VOUT) U$20.25(S7A)
LC7_OUTPUT: R29.1 U$17.1(S1) U$17.2(S2) U$17.3(S3) U$25.B19
LC7_VSENSE: R29.2 R30.1 U$20.5(S7B)
LC8_GATE: U12.12(GATE_4) U$19.4(G)
LC8_ISENSE: U19.5(VOUT) U$20.26(S8A)
LC8_OUTPUT: R31.1 U$19.1(S1) U$19.2(S2) U$19.3(S3) U$25.B26
LC8_VSENSE: R31.2 R32.1 U$20.4(S8B)
M8RXD: IC5.1(TXD) R2.1
M8TXD: IC5.5(RXD) R7.1
N$1: M2.P$1(D) M2.P$2(D) M2.P$3(D) M2.P$4(D) M2.P$5(D) M2.P$6(D) M2.P$7(D) M2.P$8(D) M2.P$9(D) M2.P$10(D) M2.P$11(D) M2.P$12(D) M2.P$13(D) M2.P$18(D) M2.P$19(D) M2.P$20(D) M2.P$21(D) M2.P$22(D) M2.P$23(D) M2.P$24(D) M2.P$25(D) M2.P$28(D) M2.P$29(D) M2.P$30(D) M2.P$31(D) M2.P$32(D) M2.P$33(D) M2.P$34(D) M2.P$37(D) M2.P$38(D) M2.P$39(D) M2.P$40(D) M2.P$41(D) M2.P$42(D) M2.P$43(D) M2.P$46(D) M2.P$47(D) M2.P$48(D) M2.P$49(D) M2.P$50(D) M2.P$51(D) M2.P$52(D) M2.P$55(D) M2.P$56(D) M2.P$57(D) M2.P$58(D) M2.P$59(D) M2.P$60(D) M2.P$61(D) M3.P$1(D) M3.P$2(D) M3.P$3(D) M3.P$4(D) M3.P$5(D) M3.P$6(D) M3.P$7(D) M3.P$8(D) M3.P$9(D) M3.P$10(D) M3.P$11(D) M3.P$12(D) M3.P$13(D) M3.P$18(D) M3.P$19(D) M3.P$20(D) M3.P$21(D) M3.P$22(D) M3.P$23(D) M3.P$24(D) M3.P$25(D) M3.P$28(D) M3.P$29(D) M3.P$30(D) M3.P$31(D) M3.P$32(D) M3.P$33(D) M3.P$34(D) M3.P$37(D) M3.P$38(D) M3.P$39(D) M3.P$40(D) M3.P$41(D) M3.P$42(D) M3.P$43(D) M3.P$46(D) M3.P$47(D) M3.P$48(D) M3.P$49(D) M3.P$50(D) M3.P$51(D) M3.P$52(D) M3.P$55(D) M3.P$56(D) M3.P$57(D) M3.P$58(D) M3.P$59(D) M3.P$60(D) M3.P$61(D) RS1.PAS2
N$2: RS1.SENSE1 U1.8(VS+)
N$3: RS1.SENSE2 U1.1(VS-)
N$4: C5.1 U1.3(FIL)
N$5: R4.2 R5.1 U2.3(+IN)
N$6: IC2.8(RS) R3.1
N$7: R11.2 R12.1 U4.3(+IN)
N$8: M5.P$1(D) M5.P$2(D) M5.P$3(D) M5.P$4(D) M5.P$5(D) M5.P$6(D) M5.P$7(D) M5.P$8(D) M5.P$9(D) M5.P$10(D) M5.P$11(D) M5.P$12(D) M5.P$13(D) M5.P$18(D) M5.P$19(D) M5.P$20(D) M5.P$21(D) M5.P$22(D) M5.P$23(D) M5.P$24(D) M5.P$25(D) M5.P$28(D) M5.P$29(D) M5.P$30(D) M5.P$31(D) M5.P$32(D) M5.P$33(D) M5.P$34(D) M5.P$37(D) M5.P$38(D) M5.P$39(D) M5.P$40(D) M5.P$41(D) M5.P$42(D) M5.P$43(D) M5.P$46(D) M5.P$47(D) M5.P$48(D) M5.P$49(D) M5.P$50(D) M5.P$51(D) M5.P$52(D) M5.P$55(D) M5.P$56(D) M5.P$57(D) M5.P$58(D) M5.P$59(D) M5.P$60(D) M5.P$61(D) M6.P$1(D) M6.P$2(D) M6.P$3(D) M6.P$4(D) M6.P$5(D) M6.P$6(D) M6.P$7(D) M6.P$8(D) M6.P$9(D) M6.P$10(D) M6.P$11(D) M6.P$12(D) M6.P$13(D) M6.P$18(D) M6.P$19(D) M6.P$20(D) M6.P$21(D) M6.P$22(D) M6.P$23(D) M6.P$24(D) M6.P$25(D) M6.P$28(D) M6.P$29(D) M6.P$30(D) M6.P$31(D) M6.P$32(D) M6.P$33(D) M6.P$34(D) M6.P$37(D) M6.P$38(D) M6.P$39(D) M6.P$40(D) M6.P$41(D) M6.P$42(D) M6.P$43(D) M6.P$46(D) M6.P$47(D) M6.P$48(D) M6.P$49(D) M6.P$50(D) M6.P$51(D) M6.P$52(D) M6.P$55(D) M6.P$56(D) M6.P$57(D) M6.P$58(D) M6.P$59(D) M6.P$60(D) M6.P$61(D) RS2.PAS1
N$9: R6.1 VCC!.A
N$10: RS2.SENSE2 U7.8(VS+)
N$11: C1.2 IC1.24(XTAL1) Q1.1
N$12: RS2.SENSE1 U7.1(VS-)
N$14: R13.2 R14.1 U5.3(+IN)
N$15: R15.2 R16.1 U6.3(+IN)
N$16: C6.1 U7.3(FIL)
N$17: M8.P$1(D) M8.P$2(D) M8.P$3(D) M8.P$4(D) M8.P$5(D) M8.P$6(D) M8.P$7(D) M8.P$8(D) M8.P$9(D) M8.P$10(D) M8.P$11(D) M8.P$12(D) M8.P$13(D) M8.P$18(D) M8.P$19(D) M8.P$20(D) M8.P$21(D) M8.P$22(D) M8.P$23(D) M8.P$24(D) M8.P$25(D) M8.P$28(D) M8.P$29(D) M8.P$30(D) M8.P$31(D) M8.P$32(D) M8.P$33(D) M8.P$34(D) M8.P$37(D) M8.P$38(D) M8.P$39(D) M8.P$40(D) M8.P$41(D) M8.P$42(D) M8.P$43(D) M8.P$46(D) M8.P$47(D) M8.P$48(D) M8.P$49(D) M8.P$50(D) M8.P$51(D) M8.P$52(D) M8.P$55(D) M8.P$56(D) M8.P$57(D) M8.P$58(D) M8.P$59(D) M8.P$60(D) M8.P$61(D) M9.P$1(D) M9.P$2(D) M9.P$3(D) M9.P$4(D) M9.P$5(D) M9.P$6(D) M9.P$7(D) M9.P$8(D) M9.P$9(D) M9.P$10(D) M9.P$11(D) M9.P$12(D) M9.P$13(D) M9.P$18(D) M9.P$19(D) M9.P$20(D) M9.P$21(D) M9.P$22(D) M9.P$23(D) M9.P$24(D) M9.P$25(D) M9.P$28(D) M9.P$29(D) M9.P$30(D) M9.P$31(D) M9.P$32(D) M9.P$33(D) M9.P$34(D) M9.P$37(D) M9.P$38(D) M9.P$39(D) M9.P$40(D) M9.P$41(D) M9.P$42(D) M9.P$43(D) M9.P$46(D) M9.P$47(D) M9.P$48(D) M9.P$49(D) M9.P$50(D) M9.P$51(D) M9.P$52(D) M9.P$55(D) M9.P$56(D) M9.P$57(D) M9.P$58(D) M9.P$59(D) M9.P$60(D) M9.P$61(D) RS3.PAS1
N$18: RS3.SENSE2 U8.8(VS+)
N$19: RS3.SENSE1 U8.1(VS-)
N$20: C7.1 U8.3(FIL)
N$21: M11.P$1(D) M11.P$2(D) M11.P$3(D) M11.P$4(D) M11.P$5(D) M11.P$6(D) M11.P$7(D) M11.P$8(D) M11.P$9(D) M11.P$10(D) M11.P$11(D) M11.P$12(D) M11.P$13(D) M11.P$18(D) M11.P$19(D) M11.P$20(D) M11.P$21(D) M11.P$22(D) M11.P$23(D) M11.P$24(D) M11.P$25(D) M11.P$28(D) M11.P$29(D) M11.P$30(D) M11.P$31(D) M11.P$32(D) M11.P$33(D) M11.P$34(D) M11.P$37(D) M11.P$38(D) M11.P$39(D) M11.P$40(D) M11.P$41(D) M11.P$42(D) M11.P$43(D) M11.P$46(D) M11.P$47(D) M11.P$48(D) M11.P$49(D) M11.P$50(D) M11.P$51(D) M11.P$52(D) M11.P$55(D) M11.P$56(D) M11.P$57(D) M11.P$58(D) M11.P$59(D) M11.P$60(D) M11.P$61(D) M12.P$1(D) M12.P$2(D) M12.P$3(D) M12.P$4(D) M12.P$5(D) M12.P$6(D) M12.P$7(D) M12.P$8(D) M12.P$9(D) M12.P$10(D) M12.P$11(D) M12.P$12(D) M12.P$13(D) M12.P$18(D) M12.P$19(D) M12.P$20(D) M12.P$21(D) M12.P$22(D) M12.P$23(D) M12.P$24(D) M12.P$25(D) M12.P$28(D) M12.P$29(D) M12.P$30(D) M12.P$31(D) M12.P$32(D) M12.P$33(D) M12.P$34(D) M12.P$37(D) M12.P$38(D) M12.P$39(D) M12.P$40(D) M12.P$41(D) M12.P$42(D) M12.P$43(D) M12.P$46(D) M12.P$47(D) M12.P$48(D) M12.P$49(D) M12.P$50(D) M12.P$51(D) M12.P$52(D) M12.P$55(D) M12.P$56(D) M12.P$57(D) M12.P$58(D) M12.P$59(D) M12.P$60(D) M12.P$61(D) RS4.PAS2
N$22: IC1.64(AVCC) L1.2
N$23: RS4.SENSE1 U9.8(VS+)
N$24: RS4.SENSE2 U9.1(VS-)
N$25: C8.1 U9.3(FIL)
N$26: F2.2 U$4.V1
N$27: U$4.V2 U$5.P$1(D) U$5.P$2(D) U$5.P$3(D) U$5.P$4(D) U$5.P$5(D) U$5.P$6(D) U$5.P$7(D) U$5.P$8(D) U$5.P$9(D) U$5.P$10(D) U$5.P$11(D) U$5.P$12(D) U$5.P$13(D) U$5.P$18(D) U$5.P$19(D) U$5.P$20(D) U$5.P$21(D) U$5.P$22(D) U$5.P$23(D) U$5.P$24(D) U$5.P$25(D) U$5.P$28(D) U$5.P$29(D) U$5.P$30(D) U$5.P$31(D) U$5.P$32(D) U$5.P$33(D) U$5.P$34(D) U$5.P$37(D) U$5.P$38(D) U$5.P$39(D) U$5.P$40(D) U$5.P$41(D) U$5.P$42(D) U$5.P$43(D) U$5.P$46(D) U$5.P$47(D) U$5.P$48(D) U$5.P$49(D) U$5.P$50(D) U$5.P$51(D) U$5.P$52(D) U$5.P$55(D) U$5.P$56(D) U$5.P$57(D) U$5.P$58(D) U$5.P$59(D) U$5.P$60(D) U$5.P$61(D)
N$28: U10.1(VS-) U$4.I2
N$29: U10.8(VS+) U$4.I1
N$30: F3.2 U$6.V1
N$31: C9.1 U10.3(FIL)
N$32: IC5.23(GPIO1) LED2.C
N$33: U$6.V2 U$7.P$1(D) U$7.P$2(D) U$7.P$3(D) U$7.P$4(D) U$7.P$5(D) U$7.P$6(D) U$7.P$7(D) U$7.P$8(D) U$7.P$9(D) U$7.P$10(D) U$7.P$11(D) U$7.P$12(D) U$7.P$13(D) U$7.P$18(D) U$7.P$19(D) U$7.P$20(D) U$7.P$21(D) U$7.P$22(D) U$7.P$23(D) U$7.P$24(D) U$7.P$25(D) U$7.P$28(D) U$7.P$29(D) U$7.P$30(D) U$7.P$31(D) U$7.P$32(D) U$7.P$33(D) U$7.P$34(D) U$7.P$37(D) U$7.P$38(D) U$7.P$39(D) U$7.P$40(D) U$7.P$41(D) U$7.P$42(D) U$7.P$43(D) U$7.P$46(D) U$7.P$47(D) U$7.P$48(D) U$7.P$49(D) U$7.P$50(D) U$7.P$51(D) U$7.P$52(D) U$7.P$55(D) U$7.P$56(D) U$7.P$57(D) U$7.P$58(D) U$7.P$59(D) U$7.P$60(D) U$7.P$61(D)
N$34: IC5.22(GPIO0) LED3.C
N$35: LED2.A R8.1
N$36: LED3.A R9.1
N$37: U13.8(VS+) U$6.I1
N$38: C10.1 U13.3(FIL)
N$39: U13.1(VS-) U$6.I2
N$40: F4.2 U$8.V1
N$41: U$8.V2 U$9.P$1(D) U$9.P$2(D) U$9.P$3(D) U$9.P$4(D) U$9.P$5(D) U$9.P$6(D) U$9.P$7(D) U$9.P$8(D) U$9.P$9(D) U$9.P$10(D) U$9.P$11(D) U$9.P$12(D) U$9.P$13(D) U$9.P$18(D) U$9.P$19(D) U$9.P$20(D) U$9.P$21(D) U$9.P$22(D) U$9.P$23(D) U$9.P$24(D) U$9.P$25(D) U$9.P$28(D) U$9.P$29(D) U$9.P$30(D) U$9.P$31(D) U$9.P$32(D) U$9.P$33(D) U$9.P$34(D) U$9.P$37(D) U$9.P$38(D) U$9.P$39(D) U$9.P$40(D) U$9.P$41(D) U$9.P$42(D) U$9.P$43(D) U$9.P$46(D) U$9.P$47(D) U$9.P$48(D) U$9.P$49(D) U$9.P$50(D) U$9.P$51(D) U$9.P$52(D) U$9.P$55(D) U$9.P$56(D) U$9.P$57(D) U$9.P$58(D) U$9.P$59(D) U$9.P$60(D) U$9.P$61(D)
N$42: U14.8(VS+) U$8.I1
N$43: C11.1 U14.3(FIL)
N$44: U14.1(VS-) U$8.I2
N$45: F5.2 U$10.V1
N$46: U$10.V2 U$11.P$1(D) U$11.P$2(D) U$11.P$3(D) U$11.P$4(D) U$11.P$5(D) U$11.P$6(D) U$11.P$7(D) U$11.P$8(D) U$11.P$9(D) U$11.P$10(D) U$11.P$11(D) U$11.P$12(D) U$11.P$13(D) U$11.P$18(D) U$11.P$19(D) U$11.P$20(D) U$11.P$21(D) U$11.P$22(D) U$11.P$23(D) U$11.P$24(D) U$11.P$25(D) U$11.P$28(D) U$11.P$29(D) U$11.P$30(D) U$11.P$31(D) U$11.P$32(D) U$11.P$33(D) U$11.P$34(D) U$11.P$37(D) U$11.P$38(D) U$11.P$39(D) U$11.P$40(D) U$11.P$41(D) U$11.P$42(D) U$11.P$43(D) U$11.P$46(D) U$11.P$47(D) U$11.P$48(D) U$11.P$49(D) U$11.P$50(D) U$11.P$51(D) U$11.P$52(D) U$11.P$55(D) U$11.P$56(D) U$11.P$57(D) U$11.P$58(D) U$11.P$59(D) U$11.P$60(D) U$11.P$61(D)
N$47: U15.8(VS+) U$10.I1
N$48: C13.1 U15.3(FIL)
N$49: U15.1(VS-) U$10.I2
N$50: F6.2 U$12.V1
N$51: U$12.V2 U$13.P$1(D) U$13.P$2(D) U$13.P$3(D) U$13.P$4(D) U$13.P$5(D) U$13.P$6(D) U$13.P$7(D) U$13.P$8(D) U$13.P$9(D) U$13.P$10(D) U$13.P$11(D) U$13.P$12(D) U$13.P$13(D) U$13.P$18(D) U$13.P$19(D) U$13.P$20(D) U$13.P$21(D) U$13.P$22(D) U$13.P$23(D) U$13.P$24(D) U$13.P$25(D) U$13.P$28(D) U$13.P$29(D) U$13.P$30(D) U$13.P$31(D) U$13.P$32(D) U$13.P$33(D) U$13.P$34(D) U$13.P$37(D) U$13.P$38(D) U$13.P$39(D) U$13.P$40(D) U$13.P$41(D) U$13.P$42(D) U$13.P$43(D) U$13.P$46(D) U$13.P$47(D) U$13.P$48(D) U$13.P$49(D) U$13.P$50(D) U$13.P$51(D) U$13.P$52(D) U$13.P$55(D) U$13.P$56(D) U$13.P$57(D) U$13.P$58(D) U$13.P$59(D) U$13.P$60(D) U$13.P$61(D)
N$52: U16.8(VS+) U$12.I1
N$53: C14.1 U16.3(FIL)
N$54: U16.1(VS-) U$12.I2
N$55: F7.2 U$14.V1
N$56: U$14.V2 U$15.P$1(D) U$15.P$2(D) U$15.P$3(D) U$15.P$4(D) U$15.P$5(D) U$15.P$6(D) U$15.P$7(D) U$15.P$8(D) U$15.P$9(D) U$15.P$10(D) U$15.P$11(D) U$15.P$12(D) U$15.P$13(D) U$15.P$18(D) U$15.P$19(D) U$15.P$20(D) U$15.P$21(D) U$15.P$22(D) U$15.P$23(D) U$15.P$24(D) U$15.P$25(D) U$15.P$28(D) U$15.P$29(D) U$15.P$30(D) U$15.P$31(D) U$15.P$32(D) U$15.P$33(D) U$15.P$34(D) U$15.P$37(D) U$15.P$38(D) U$15.P$39(D) U$15.P$40(D) U$15.P$41(D) U$15.P$42(D) U$15.P$43(D) U$15.P$46(D) U$15.P$47(D) U$15.P$48(D) U$15.P$49(D) U$15.P$50(D) U$15.P$51(D) U$15.P$52(D) U$15.P$55(D) U$15.P$56(D) U$15.P$57(D) U$15.P$58(D) U$15.P$59(D) U$15.P$60(D) U$15.P$61(D)
N$57: U17.8(VS+) U$14.I1
N$58: C17.1 U17.3(FIL)
N$59: U17.1(VS-) U$14.I2
N$60: F8.2 U$16.V1
N$61: U$16.V2 U$17.P$1(D) U$17.P$2(D) U$17.P$3(D) U$17.P$4(D) U$17.P$5(D) U$17.P$6(D) U$17.P$7(D) U$17.P$8(D) U$17.P$9(D) U$17.P$10(D) U$17.P$11(D) U$17.P$12(D) U$17.P$13(D) U$17.P$18(D) U$17.P$19(D) U$17.P$20(D) U$17.P$21(D) U$17.P$22(D) U$17.P$23(D) U$17.P$24(D) U$17.P$25(D) U$17.P$28(D) U$17.P$29(D) U$17.P$30(D) U$17.P$31(D) U$17.P$32(D) U$17.P$33(D) U$17.P$34(D) U$17.P$37(D) U$17.P$38(D) U$17.P$39(D) U$17.P$40(D) U$17.P$41(D) U$17.P$42(D) U$17.P$43(D) U$17.P$46(D) U$17.P$47(D) U$17.P$48(D) U$17.P$49(D) U$17.P$50(D) U$17.P$51(D) U$17.P$52(D) U$17.P$55(D) U$17.P$56(D) U$17.P$57(D) U$17.P$58(D) U$17.P$59(D) U$17.P$60(D) U$17.P$61(D)
N$62: U18.8(VS+) U$16.I1
N$63: C21.1 U18.3(FIL)
N$64: U18.1(VS-) U$16.I2
N$65: F9.2 U$18.V1
N$66: U$18.V2 U$19.P$1(D) U$19.P$2(D) U$19.P$3(D) U$19.P$4(D) U$19.P$5(D) U$19.P$6(D) U$19.P$7(D) U$19.P$8(D) U$19.P$9(D) U$19.P$10(D) U$19.P$11(D) U$19.P$12(D) U$19.P$13(D) U$19.P$18(D) U$19.P$19(D) U$19.P$20(D) U$19.P$21(D) U$19.P$22(D) U$19.P$23(D) U$19.P$24(D) U$19.P$25(D) U$19.P$28(D) U$19.P$29(D) U$19.P$30(D) U$19.P$31(D) U$19.P$32(D) U$19.P$33(D) U$19.P$34(D) U$19.P$37(D) U$19.P$38(D) U$19.P$39(D) U$19.P$40(D) U$19.P$41(D) U$19.P$42(D) U$19.P$43(D) U$19.P$46(D) U$19.P$47(D) U$19.P$48(D) U$19.P$49(D) U$19.P$50(D) U$19.P$51(D) U$19.P$52(D) U$19.P$55(D) U$19.P$56(D) U$19.P$57(D) U$19.P$58(D) U$19.P$59(D) U$19.P$60(D) U$19.P$61(D)
N$67: U19.8(VS+) U$18.I1
N$68: C22.1 U19.3(FIL)
N$69: U19.1(VS-) U$18.I2
N$73: R47.1 U22.3(~FAULT)
N$101: U$25.A6
N$105: U$25.A5
N$106: U$25.B4
PA0: IC1.51((AD0)PA0) U11.9(INPUT_4)
PA1: IC1.50((AD1)PA1) U12.3(INPUT_1)
PA2: IC1.49((AD2)PA2) U12.5(INPUT_2)
PA3: IC1.48((AD3)PA3) U12.7(INPUT_3)
PA4: IC1.47((AD4)PA4) U12.9(INPUT_4)
PA5: IC1.46((AD5)PA5)
PA6: IC1.45((AD6)PA6)
PA7: IC1.44((AD7)PA7)
PB4(PWM): IC1.14((OC2A)PB4) U$3.16(E1)
PB5(PWM): IC1.15((OC1A)PB5) U$3.14(E2)
PB6(PWM): IC1.16((OC1B)PB6) U$3.12(E3)
PB7(PWM): IC1.17((OC0A/OC1C)PB7) U$3.10(E4)
PC0: IC1.35((A8)PC0) U20.1(A0) U$20.17(A0)
PC1: IC1.36((A9)PC1) U20.16(A1) U$20.16(A1)
PC2: IC1.37((A10)PC2) U$20.15(A2)
PC3: IC1.38((A11)PC3)
PC4: IC1.39((A12)PC4)
PC5: IC1.40((A13)PC5)
PC6: IC1.41((A14)PC6)
PC7: IC1.42((A15/CLKO)PC7)
PD4: IC1.29((ICP1)PD4)
PD7: IC1.32((T0)PD7)
PE2: IC1.4((XCK0/AIN0)PE2)
PE3(PWM): IC1.5((OC3A/AIN1)PE3) U11.3(INPUT_1)
PE4(PWM): IC1.6((OC3B/INT4)PE4) U11.5(INPUT_2)
PE5(PWM): IC1.7((OC3C/INT5)PE5) U11.7(INPUT_3)
PE6: IC1.8((T3/INT6)PE6)
PG0: IC1.33(PG0(WR))
PG1: IC1.34(PG1(RD))
PG2: IC1.43(PG2(ALE))
RECTIFIER_GATE: M1.4(G) M4.4(G) M7.4(G) U22.5(GATE)
RECTIFIER_IN: M1.P$1(D) M1.P$2(D) M1.P$3(D) M1.P$4(D) M1.P$5(D) M1.P$6(D) M1.P$7(D) M1.P$8(D) M1.P$9(D) M1.P$10(D) M1.P$11(D) M1.P$12(D) M1.P$13(D) M1.P$18(D) M1.P$19(D) M1.P$20(D) M1.P$21(D) M1.P$22(D) M1.P$23(D) M1.P$24(D) M1.P$25(D) M1.P$28(D) M1.P$29(D) M1.P$30(D) M1.P$31(D) M1.P$32(D) M1.P$33(D) M1.P$34(D) M1.P$37(D) M1.P$38(D) M1.P$39(D) M1.P$40(D) M1.P$41(D) M1.P$42(D) M1.P$43(D) M1.P$46(D) M1.P$47(D) M1.P$48(D) M1.P$49(D) M1.P$50(D) M1.P$51(D) M1.P$52(D) M1.P$55(D) M1.P$56(D) M1.P$57(D) M1.P$58(D) M1.P$59(D) M1.P$60(D) M1.P$61(D) M4.P$1(D) M4.P$2(D) M4.P$3(D) M4.P$4(D) M4.P$5(D) M4.P$6(D) M4.P$7(D) M4.P$8(D) M4.P$9(D) M4.P$10(D) M4.P$11(D) M4.P$12(D) M4.P$13(D) M4.P$18(D) M4.P$19(D) M4.P$20(D) M4.P$21(D) M4.P$22(D) M4.P$23(D) M4.P$24(D) M4.P$25(D) M4.P$28(D) M4.P$29(D) M4.P$30(D) M4.P$31(D) M4.P$32(D) M4.P$33(D) M4.P$34(D) M4.P$37(D) M4.P$38(D) M4.P$39(D) M4.P$40(D) M4.P$41(D) M4.P$42(D) M4.P$43(D) M4.P$46(D) M4.P$47(D) M4.P$48(D) M4.P$49(D) M4.P$50(D) M4.P$51(D) M4.P$52(D) M4.P$55(D) M4.P$56(D) M4.P$57(D) M4.P$58(D) M4.P$59(D) M4.P$60(D) M4.P$61(D) M7.P$1(D) M7.P$2(D) M7.P$3(D) M7.P$4(D) M7.P$5(D) M7.P$6(D) M7.P$7(D) M7.P$8(D) M7.P$9(D) M7.P$10(D) M7.P$11(D) M7.P$12(D) M7.P$13(D) M7.P$18(D) M7.P$19(D) M7.P$20(D) M7.P$21(D) M7.P$22(D) M7.P$23(D) M7.P$24(D) M7.P$25(D) M7.P$28(D) M7.P$29(D) M7.P$30(D) M7.P$31(D) M7.P$32(D) M7.P$33(D) M7.P$34(D) M7.P$37(D) M7.P$38(D) M7.P$39(D) M7.P$40(D) M7.P$41(D) M7.P$42(D) M7.P$43(D) M7.P$46(D) M7.P$47(D) M7.P$48(D) M7.P$49(D) M7.P$50(D) M7.P$51(D) M7.P$52(D) M7.P$55(D) M7.P$56(D) M7.P$57(D) M7.P$58(D) M7.P$59(D) M7.P$60(D) M7.P$61(D) U$25.B17 U$25.B24
RECTIFIER_OUT: M1.1(S1) M1.2(S2) M1.3(S3) M4.1(S1) M4.2(S2) M4.3(S3) M7.1(S1) M7.2(S2) M7.3(S3) U$25.B18 U$25.B25
RESET: C16.1 C20.2 D1.A H7.5 IC1.20(RESET) R1.1 SJ1.2
RX: H7.4 IC1.2((RXD0/PDI)PE0) R2.2
RXCAN: IC1.31((RXCAN/T1)PD6) IC2.4(RXD)
TEMP_SENSE: IC1.57(PF4(ADC4/TCK)) U$21.2(VOUT)
TX: H7.1 IC1.3((TXD0/PDO)PE1) R7.2
TXCAN: IC1.30((TXCAN/XCK1)PD5) IC2.1(TXD)
USB_V_IN [usbvcc]: F1.2 U$25.A13
VCC: C12.1 C19.1 C24.1 D1.C F1.1 H7.2 IC1.21(VCC) IC1.52(VCC_52) IC5.4(VCCIO) IC5.19(RESET#) IC5.20(VCC5I) L1.1 R1.2 R6.2 R8.2 R9.2 R10.1 U2.5(V+) U4.5(V+) U5.5(V+) U6.5(V+) U7.2(VCC) U8.2(VCC) U9.2(VCC) U10.2(VCC) U13.2(VCC) U14.2(VCC) U15.2(VCC) U16.2(VCC) U17.2(VCC) U18.2(VCC) U19.2(VCC) U20.2(EN) U20.14(V+) U21.1(VDD) U21.5(REFIN) U$20.1(V+) U$20.18(EN) U$21.1(VDD) U$26.2(OUTPUT) U$26.4(OUTPUT)
VCC3O: C18.1 IC5.17(VCC30)
XTAL1: C2.2 IC1.23(XTAL2) Q1.2
Unconnected: IC1.18(PG3(TOSC2)) IC1.19(PG4(TOSC1)) IC2.5(VREF) IC5.3(RTS#) IC5.6(RI#) IC5.8(VCC3I-NC) IC5.9(DSR#) IC5.10(DCD#) IC5.11(CTS#) IC5.12(SLEEP#) IC5.13(GPIO2) IC5.14(GPIO3) IC5.24(AVCC-NC) IC5.27(OSCI) IC5.28(OSCO) U3.2(TIMER1) U3.4(TIMER_2) U3.6(TIMER_3) U3.8(TIMER_4) U10.6(A2) U11.2(TIMER1) U11.4(TIMER_2) U11.6(TIMER_3) U11.8(TIMER_4) U12.2(TIMER1) U12.4(TIMER_2) U12.6(TIMER_3) U12.8(TIMER_4) U13.6(A2) U14.6(A2) U15.6(A2) U16.6(A2) U17.6(A2) U18.6(A2) U19.6(A2) U22.2(TIMER) U22.7(NC) U$4V5V.P1 U$4V5V.P3 U$4V5V.P5 U$4V5V.P7 U$4V5V.P8

## Notes on the sheet
- Low Current Outputs and Gate Drive
- High Current Outputs
- AVR CONNECTIONS
- Mounting Holes
- CAN
- Input Current Limiting
- Analog HC Overcurrent Redundancy
- FTDI Interface
- RESET PIN | Modified from Arduino Duemilanove schematics
- Copyright (C) 2009 M. Banzi, D. Cuartielles, T. Igoe, G. Martino, D. Mellis
- Arduino material originally licensed CC-BY-SA 3.0
- POWER SUPPLY
- E-Stop and gate drive
- MAX6350CSA
- Signal to ADC Multiplexing
- Temperature Sensing
- Rectifier Shutdown
- Connectors

## Power pins joined to a net without a drawn wire
GND: IC2.2(GND)
VCC: IC2.3(VCC) U1.2(VCC)

## Library data of the parts
C1-C14 C17-C24 = rcl:C-US: CAPACITOR, American symbol
C16 = SparkFun-Capacitors:CAP: Capacitor Standard 0603 ceramic capacitor, and 0.1" leaded capacitor.
D1 = adafruit:DIODE: Diode SMADIODE - SMA Surface Mount Package 20V 1A Schottky Diode Digikey: 641-1014-6-ND DO-1N4148 - Through Hole Small Current Diode SOD-123 20V 1 A (.5mV Vf) Schottky Diode - Digikey: MBRX120TPMSCT-ND SOD-323 10V 570mA (.38mV Vf, 3ns) Schottky Diode - Digikey: ZLLS410CT-ND SOD-523 30V 30mA Schottky Diode (RB751S-40TE61) - Digikey: RB751S-40TE61CT-ND SOT23-R/W - SOT23 Package (R = Solder Paste/Reflow Ovens, W = Hand-Soldering) BAT54Film 40V 300mA - Digikey: 497-7162-1-ND
D2 = diode:1N581*: 1.0A SCHOTTKY BARRIER RECTIFIER Source: http://www.diodes.com/datasheets/ds23001.pdf
F1 = SparkFun:PTC: Resettable Fuse PTC Resettable Fuse. Spark Fun Electronics SKU : COM-08357
F2-F9 = LittleFuse:PTC_FUSE: Polyfuse Resettable PTC Source: http://www.littelfuse.com/products/resettable-ptcs.aspx; MF: Littelfuse; MPN: 2920L200; OC_FARNELL: 1822229; OC_NEWARK: 18M4796
H1-H4 = holes:MOUNT-PAD-ROUND: MOUNTING PAD, round
H7 = SparkFun-Connectors:M03X2: 2x3 .1" header. Shrouded, with keying- CONN-10681 SMT- CONN-11415 Pogo pins- HW-11044
IC1 = at90can128:AT90CAN128
IC2 = can:MCP2551: CAN Tranceiver Microchip
IC3 = Artificial Science:NUP2105L
IC5 = SmartPrj:FT232RL
L1 = rcl:L-US: INDUCTOR, American symbol
LED2 LED3 VCC! = led:LED: LED OSRAM: - CHIPLED LG R971, LG N971, LY N971, LG Q971, LY Q971, LO R971, LY R971 LH N974, LH R974 LS Q976, LO Q976, LY Q976 LO Q996 - Hyper CHIPLED LW Q18S LB Q993, LB Q99A, LB R99A - SideLED LS A670, LO A670, LY A670, LG A670, LP A670 LB A673, LV A673, LT A673, LW A673 LH A674 LY A675 LS A676, LA A676, LO A676, LY A676, LW A676 LS A679, LY A679, LG A679 - Hyper Micro SIDELED® LS Y876, LA Y876, LO Y876, LY Y876 LT Y87S - SmartLED LW L88C, LW L88S LB L89C, LB L89S, LG L890 LS L89K, LO L89K, LY L89K LS L896, LA L896, LO L896, LY L896 - TOPLED LS T670, LO T670, LY T670, LG T670, LP T670 LSG T670, LSP T670, LSY T670, LOP T670, LYG T670 LG T671, LOG T671, LSG T671 LB T673, LV T673, LT T673, LW T673 LH T674 LS T676, LA T676, LO T676, LY T676, LB T676, LH T676, LSB T676, LW T676 LB T67C, LV T67C, LT T67C, LS T67K, LO T67K, LY T67K, LW E67C LS E67B, LA E67B, LO E67B, LY E67B, LB E67C, LV E67C, LT E67C LW T67C LS T679, LY T679, LG T679 LS T770, LO T770, LY T770, LG T770, LP T770 LB T773, LV T773, LT T773, LW T773 LH T774 LS E675, LA E675, LY E675, LS T675 LS T776, LA T776, LO T776, LY T776, LB T776 LHGB T686 LT T68C, LB T68C - Hyper Mini TOPLED® LB M676 - Mini TOPLED Santana® LG M470 LS M47K, LO M47K, LY M47K Source: http://www.osram.convergy.de LUXEON: - LUMILED® LXK2-PW12-R00, LXK2-PW12-S00, LXK2-PW14-U00, LXK2-PW14-V00 LXK2-PM12-R00, LXK2-PM12-S00, LXK2-PM14-U00 LXK2-PE12-Q00, LXK2-PE12-R00, LXK2-PE12-S00, LXK2-PE14-T00, LXK2-PE14-U00 LXK2-PB12-K00, LXK2-PB12-L00, LXK2-PB12-M00, LXK2-PB14-N00, LXK2-PB14-P00, LXK2-PB14-Q00 LXK2-PR12-L00, LXK2-PR12-M00, LXK2-PR14-Q00, LXK2-PR14-R00 LXK2-PD12-Q00, LXK2-PD12-R00, LXK2-PD12-S00 LXK2-PH12-R00, LXK2-PH12-S00 LXK2-PL12-P00, LXK2-PL12-Q00, LXK2-PL12-R00 Source: www.luxeon.com KINGBRIGHT: KA-3528ASYC Source: www.kingbright.com
M1-M9 M11 M12 U$5 U$7 U$9 U$11 U$13 U$15 U$17 U$19 = NXP_By_element14_Batch_1:PSMN2R2-25YLC
Q1 = SparkFun-FreqCtrl:CRYSTAL: Various standard crystals. Proven footprints. Spark Fun Electronics SKU : COM-00534
R1-R49 = rcl:R-US_: RESISTOR, American symbol
RS1-RS4 = vishay:WSL2726_RES
SJ1 = SparkFun-Passives:SOLDERJUMPER: Solder Jumper Standard SMD solder jumper. Used to automate production. Two varients : Normally Open and Normally Closed are the same, but have different paste layers. NC will have a large amount of paste and should jumper during reflow.
U1 U7-U10 U13-U19 = LTC_By_element14_Batch_1:LT6100HMS8PBF: Precision, Gain Selectable High Side Current Sense Amplifier; MPN: LT6100HMS8#PBF; OC_FARNELL: 1330750; OC_NEWARK: 57M9125; PACKAGE: MSOP-8; SUPPLIER: Linear Technology
U2 U4-U6 = LTC_By_element14_Batch_1:LT1716IS5PBF: Rail-to-Rail Comparator; MPN: LT1716IS5#PBF; OC_FARNELL: 1531486; OC_NEWARK: 61M3351; PACKAGE: TSOT-23-5; SUPPLIER: Linear Technology
U3 U11 U12 = LTC_By_element14_Batch_1:LT1161ISWPBF: Quad Protected High-Side MOSFET Driver; MPN: LT1161ISW#PBF; OC_FARNELL: 1499449; OC_NEWARK: 57M2271; PACKAGE: SOIC-20; SUPPLIER: Linear Technology
U20 = Vishay_By_element14_Batch_1:DG409DY-E3: CMOS Analog Multiplexers; MPN: DG409DY-E3; OC_FARNELL: 1077098; OC_NEWARK: 49K9567; PACKAGE: SOIC-16; SUPPLIER: Vishay
U21 = Analog Devices_By_element14_Batch_1:AD5314WARMZ-REEL7: DAC; MPN: AD5314WARMZ-REEL7; OC_FARNELL: -; OC_NEWARK: 11R1003; PACKAGE: MSOP-10; SUPPLIER: Analog Devices
U22 = LTC_By_element14_Batch_1:LT1910IS8TRPBF: Protected High Side MOSFET Driver; MPN: LT1910IS8#TRPBF; OC_FARNELL: -; OC_NEWARK: 25R2546; PACKAGE: SOIC-8; SUPPLIER: Linear Technology
U$2 = on-semiconductor:MMPQ3904
U$3 = on-semiconductor:MMPQ3906
U$4 U$6 U$8 U$10 U$12 U$14 U$16 U$18 = ohmite:LVK_SERIES
U$4V5V = DashAndCAN library:MAX6350CSA
U$20 = vishay:DG407
U$21 = microchip:MCP970X: Temperature Sensor IC
U$22-U$24 = diodes-inc:AZ23C4V7-7-F
U$25 = TE:SUPERSEAL1.0_60POS
U$26 = on-semiconductor:NCP1117